# EasyEDA Pro project 15P2D_EDA.eprj

# Schematic SCH

## Sheets
1 P1: Board Name: B1; Create Date: 2024-03-08; Page Name: P1; Project Name: 15P2D_EDA; Schematic Name: SCH; Update Date: 2024-04-16; Company: 嘉立创EDA; Page Size: A4; Version: V1.0
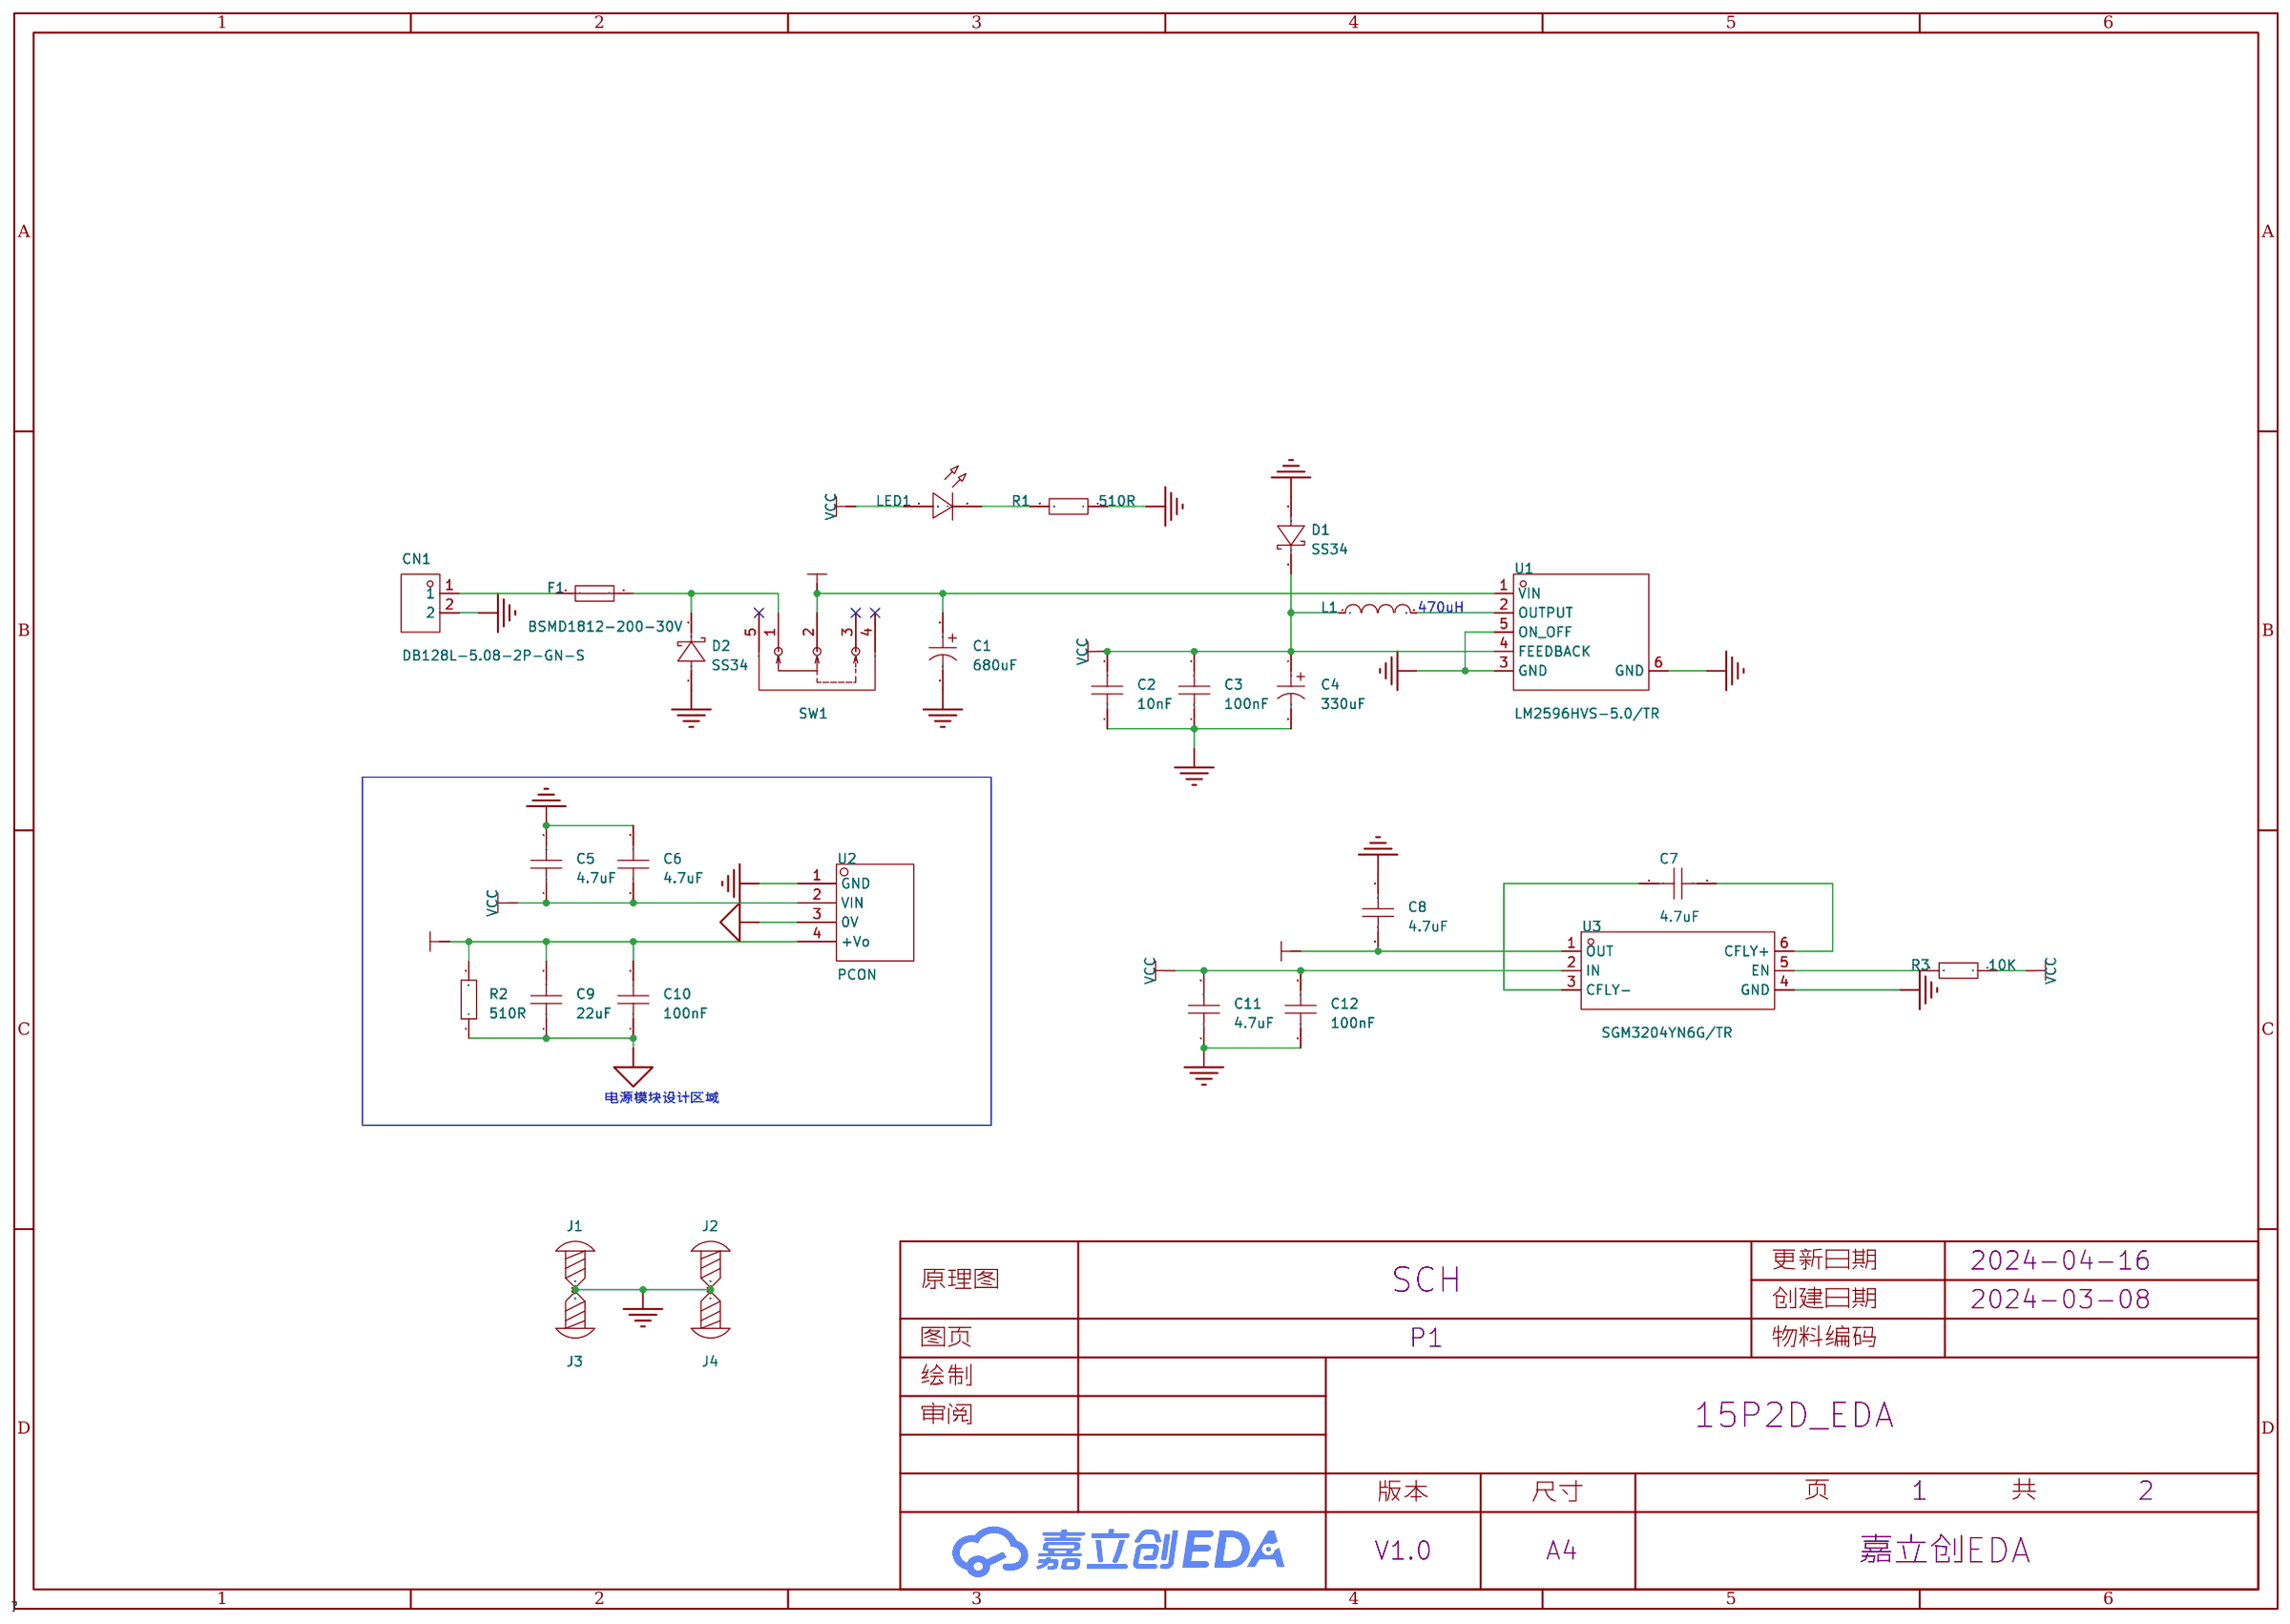
[diagram p0: P1]
2 P2: Create Date: 2024-03-11; Page Name: P2; Update Date: 2024-04-10; Company: EDA设计与开发
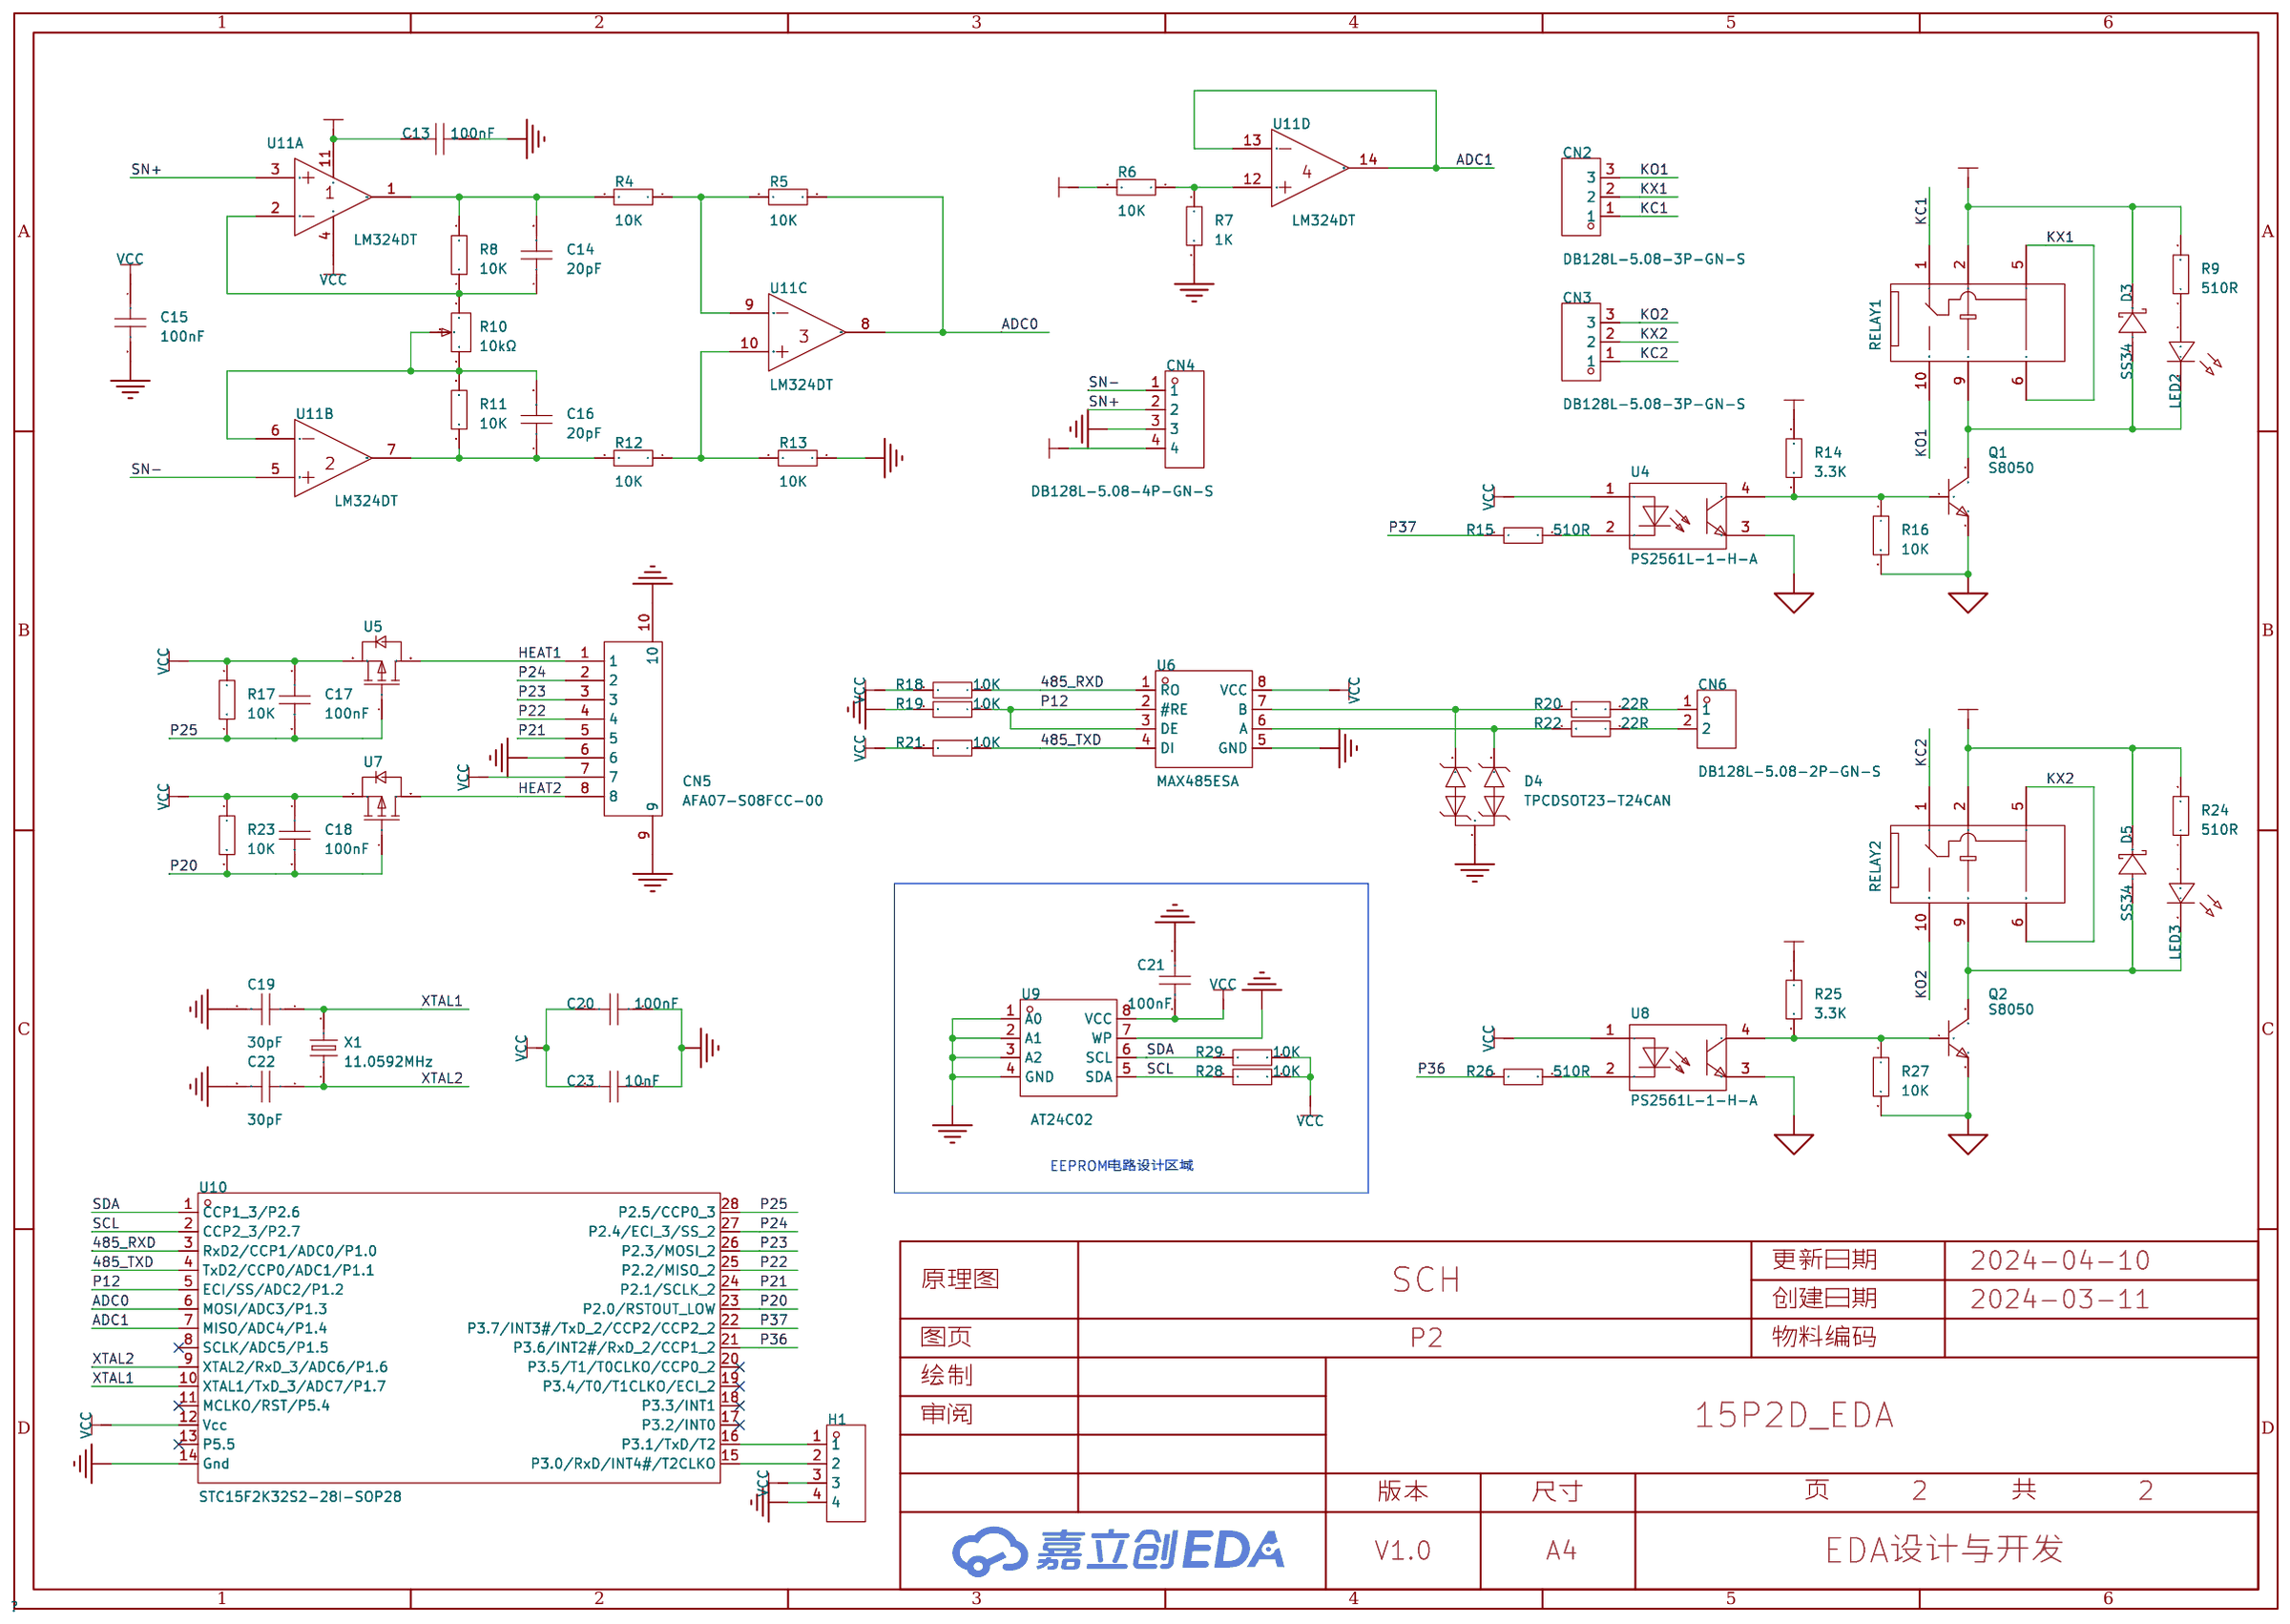
[diagram p1: P2]

## Parts
sheet P1
C1  680uF  [CAP-SMD_BD10.0-L10.3-W10.3-LS11.3-FD]
C2  10nF  [C0805]
C3  100nF  [C0805]
C4  330uF  [CAP-SMD_BD6.3-L6.6-W6.6-LS7.6-RD]
C5  4.7uF  [C1206]
C6  4.7uF  [C1206]
C7  4.7uF  [C1206]
C8  4.7uF  [C1206]
C9  22uF  [C1206]
C10  100nF  [C0805]
C11  4.7uF  [C1206]
C12  100nF  [C0805]
CN1  DB128L-5.08-2P-GN-S  [CONN-TH_2P-P5.08_DB128L-5.08-2P]
D1  SS34  [SMA_L4.3-W2.6-LS5.1-RD]
D2  SS34  [SMA_L4.3-W2.6-LS5.1-RD]
F1  BSMD1812-200-30V  [F1812]
J1  -  [M2螺丝]
J2  -  [M2螺丝]
J3  -  [M2螺丝]
J4  -  [M2螺丝]
L1  470uH  [IND-SMD_L4.0-W4.0]
LED1  -  [LED_TH-3mm]
R1  510R  [R0805]
R2  510R  [R0805]
R3  10K  [R0805]
SW1  SK12D07VG4  [SW-TH_SK12D07VG4]
U1  LM2596HVS-5.0/TR  [TO-263-5_L10.2-W8.9-P1.70-LS15.2-BR]
U2  PCON  [TH_PCON]
U3  SGM3204YN6G/TR  [SOT-23-6_L2.9-W1.6-P0.95-LS2.8-BR]
sheet P2
C13  100nF  [C0805]
C14  20pF  [C0805]
C15  100nF  [C0805]
C16  20pF  [C0805]
C17  100nF  [C0805]
C18  100nF  [C0805]
C19  30pF  [C0805]
C20  100nF  [C0805]
C21  100nF  [C0805]
C22  30pF  [C0805]
C23  10nF  [C0805]
CN2  DB128L-5.08-3P-GN-S  [CONN-TH_DB128L-5.08-3P]
CN3  DB128L-5.08-3P-GN-S  [CONN-TH_DB128L-5.08-3P]
CN4  DB128L-5.08-4P-GN-S  [CONN-TH_4P_DB128L-5.08-4P-GN-S]
CN5  AFA07-S08FCC-00  [FPC-SMD_P1.00-8P_LCS-XJ-H2.5]
CN6  DB128L-5.08-2P-GN-S  [CONN-TH_2P-P5.08_DB128L-5.08-2P]
D3  SS34  [SMA_L4.3-W2.6-LS5.1-RD]
D4  TPCDSOT23-T24CAN  [SOT-23_L2.9-W1.3-P1.90-LS2.4-BR]
D5  SS34  [SMA_L4.3-W2.6-LS5.1-RD]
H1  -  [HDR-TH_4P-P2.54-V-F]
LED2  -  [LED_TH-3mm]
LED3  -  [LED_TH-3mm]
Q1  S8050  [SOT-23_L2.9-W1.3-P1.90-LS2.4-BR]
Q2  S8050  [SOT-23_L2.9-W1.3-P1.90-LS2.4-BR]
R4  10K  [R0805]
R5  10K  [R0805]
R6  10K  [R0805]
R7  1K  [R0805]
R8  10K  [R0805]
R9  510R  [R0805]
R10  10kΩ  [RES-ADJ-TH_3P-L10.0-W10.0-P2.50-BL-BS]
R11  10K  [R0805]
R12  10K  [R0805]
R13  10K  [R0805]
R14  3.3K  [R0805]
R15  510R  [R0805]
R16  10K  [R0805]
R17  10K  [R0805]
R18  10K  [R0805]
R19  10K  [R0805]
R20  22R  [R0805]
R21  10K  [R0805]
R22  22R  [R0805]
R23  10K  [R0805]
R24  510R  [R0805]
R25  3.3K  [R0805]
R26  510R  [R0805]
R27  10K  [R0805]
R28  10K  [R0805]
R29  10K  [R0805]
RELAY1  G5V-1 DC5  [RELAY-TH_G5V-1]
RELAY2  G5V-1 DC5  [RELAY-TH_G5V-1]
U4  PS2561L-1-H-A  [SOP-4_L6.5-W4.6-P2.54-LS9.6-TL]
U5  SI2301-ZE  [SOT-23_L2.9-W1.3-P1.90-LS2.4-BR]
U6  MAX485ESA  [SOP-8_L5.0-W4.0-P1.27-LS6.0-BL]
U7  SI2301-ZE  [SOT-23_L2.9-W1.3-P1.90-LS2.4-BR]
U8  PS2561L-1-H-A  [SOP-4_L6.5-W4.6-P2.54-LS9.6-TL]
U9  AT24C02  [SOP-8_L4.9-W3.9-P1.27-LS6.0-BL]
U10  STC15F2K32S2-28I-SOP28  [SOP-28_L17.9-W7.5-P1.27-LS10.3-BL]
U11  LM324DT  [SOIC-14_L8.7-W3.9-P1.27-LS6.0-BL]  (sections 1,2,3,4)
X1  11.0592MHz  [HC-49US_L11.5-W4.5-P4.88]

## Library data of the parts
C1 = 126RV0105: 容值:680uF;精度:±20%;额定电压:35V;纹波电流:380mA;; LCSC Part Name: 680uF ±20% 35V; Supplier Part: C7461236; Manufacturer: KNSCHA(科尼盛); Supplier Footprint: SMD,D10xL10.5mm; JLCPCB Part Class: Extended Part; Datasheet: https://atta.szlcsc.com/upload/public/pdf/source/20230711/6451BDCB5B323B6F7EF00B061BF0BEEC.pdf; Supplier: LCSC; Tolerance: ±20%; Rated Voltage: 35V; Ripple Current: 380mA; φD: 10mm; L: 10.5mm; Lifetime @ Temp: 2000hrs@105℃; Operating Temperature: -55℃~+105℃
C2 C3 C10 C12-C23 = CAP_0805: Supplier Footprint: 0805
C4 = 126RV0107: 容值:330uF;精度:±20%;额定电压:16V;纹波电流:170mA;; LCSC Part Name: 330uF ±20% 16V; Supplier Part: C7461238; Manufacturer: KNSCHA(科尼盛); Supplier Footprint: SMD,D6.3xL7.7mm; JLCPCB Part Class: Extended Part; Datasheet: https://atta.szlcsc.com/upload/public/pdf/source/20230711/6451BDCB5B323B6F7EF00B061BF0BEEC.pdf; Supplier: LCSC; Tolerance: ±20%; Rated Voltage: 16V; Ripple Current: 170mA; φD: 6.3mm; L: 7.7mm; Lifetime @ Temp: 2000hrs@105℃; Operating Temperature: -55℃~+105℃
C5-C9 C11 = CL31A226KOHNNNE: 容值:22uF;精度:±10%;额定电压:16V;材质(温度系数):X5R;; LCSC Part Name: 22uF ±10% 16V; Supplier Part: C90146; Manufacturer: SAMSUNG(三星); Supplier Footprint: 1206; JLCPCB Part Class: 扩展库; Datasheet: https://atta.szlcsc.com/upload/public/pdf/source/20161228/1482890861309.pdf; Supplier: LCSC; Tolerance: ±10%; Voltage Rated: 16V; Temperature Coefficient: X5R
CN1 CN6 = DB128L-5.08-2P-GN-S: 结构:1x2P;间距:5.08mm;颜色:绿色;安装方式:直插;额定电流:18A;额定电压:250V;排数:1;线规 - AWG:12~30;线规 - 平方毫米:2.5;每排PIN数:2;工作温度范围:-40℃~+105℃;; LCSC Part Name: 5.08mm 1x2P 排数:1 每排P数:2 直插; Supplier Part: C395868; Manufacturer: DORABO(地博电气); Supplier Footprint: 插件,P=5.08mm; JLCPCB Part Class: 扩展库; Datasheet: https://atta.szlcsc.com/upload/public/pdf/source/20230106/B067FE0E641A396A370D47F93C345689.pdf; Supplier: LCSC; Structure: 1x2P; Pitch: 5.08mm; Color: 绿色; Mounting Style: 直插; Current Rating (Max): 18A; Voltage Rating (Max): 250V; Number of Pins: 2P; Number of Rows: 1; Wire Gauge - AWG: 12~30; Wire Gauge - mm2: 2.5; Number of PINs Per Row: 2; Operating Temperature Range: -40℃~+105℃
D1-D3 D5 = SS34_C727060: 二极管配置:独立式;正向压降(Vf):550mV@3A;直流反向耐压(Vr):40V;平均整流电流(Io):3A;; LCSC Part Name: 电压:40V 电流:3A; Supplier Part: C727060; Manufacturer: TWGMC(台湾迪嘉); Supplier Footprint: SMA(DO-214AC); JLCPCB Part Class: 扩展库; Datasheet: https://atta.szlcsc.com/upload/public/pdf/source/20200828/C727059_6599B6CAC5F3238B9C33E46794659DBE.pdf; Supplier: LCSC; Diode Configuration: 独立式; Forward Voltage (Vf@If): 550mV@3A; Reverse Voltage (Vr): 40V; Average Rectified Current (Io): 3A; Reverse Leakage Current (Ir): 500uA@40V
F1 = BSMD1812-200-30V: 最大电压:30V;最大电流:40A;保持电流:2A;跳闸电流:4A;; LCSC Part Name: 30V 2A 1812自恢复; Supplier Part: C960026; Manufacturer: BHFUSE(佰宏); Supplier Footprint: 1812; JLCPCB Part Class: 扩展库; Datasheet: https://atta.szlcsc.com/upload/public/pdf/source/20230512/6ED7FF50F668B3AF958C55F12246A840.pdf; Supplier: LCSC; Operating Voltage (Max): 30V; Current Rating (Max): 40A; Hold Current: 2A; Trip Current: 4A; Power Dissipation: 1W; Resistance - Initial (Ri) (Min): 20mΩ; Resistance - Post Trip (R1) (Max): 100mΩ; Maximum Time to Trip: 2s; Operating Temperature: -40℃~+85℃
J1-J4 = M2螺丝: Supplier Footprint: 插件
L1 = YPRH1209-471M: 电感值:470uH;精度:±20%;额定电流:1.06A;; LCSC Part Name: 470uH ±20%; Supplier Part: C718309; Manufacturer: YJYCOIN(益嘉源); Supplier Footprint: SMD,12x12mm; JLCPCB Part Class: 扩展库; Datasheet: https://atta.szlcsc.com/upload/public/pdf/source/20200623/C339955_D39FA66995A9BB8553FDBD7D9E6E5CB5.pdf; Supplier: LCSC; Tolerance: ±20%; Rated Current: 1.06A; DC Resistance (DCR): 471mΩ
LED1 = LED_TH-R_3mm: Supplier Footprint: 插件
R1-R9 R11-R29 = Res_0805: Supplier Footprint: 0805
SW1 = SK12D07VG4: 电路结构:单刀双掷;安装方式:侧插;额定电流(DC):500mA;额定电压(DC):50V;额定电流(AC):-;额定电压(AC):-;机械寿命:5千次;; LCSC Part Name: 3脚2档位 卧插 滑动开关; Supplier Part: C393937; Manufacturer: SHOU HAN(首韩); Supplier Footprint: 插件; JLCPCB Part Class: 扩展库; Datasheet: https://atta.szlcsc.com/upload/public/pdf/source/20190521/C393937_939FE26E571CC67D2D532E953108A1B0.pdf; Supplier: LCSC; Circuit: 单刀双掷; Actuator Style: 矩形柱状; Pin Style: PC引脚; Switch Height: 8.8mm; Mounting Style: 侧插; Current Rating (DC): 500mA; Voltage Rating (DC): 50V; Mechanical Life: 5千次
U1 = LM2596HVS-5.0/TR: Supplier Part: C7421039; Manufacturer: HGSEMI(华冠); Supplier Footprint: TO-263-5; Datasheet: https://atta.szlcsc.com/upload/public/pdf/source/20230608/50F81A07F1CB4120FC66F79925E72406.pdf; Supplier: LCSC
U2 = PCON
U3 = SGM3204YN6G/TR: 功能类型:-;输入电压:1.4V~5.5V;输出电压:-5.5V~-1.4V;输出电流(最大值):200mA;; Supplier Part: C194031; Manufacturer: SGMICRO(圣邦微); Supplier Footprint: SOT-23-6; JLCPCB Part Class: 扩展库; Datasheet: https://atta.szlcsc.com/upload/public/pdf/source/20180627/C194031_755051E53122D645C36CF727711B963E.pdf; Supplier: LCSC; Input Voltage: 1.4V~5.5V; Output Voltage: -5.5V~-1.4V; Output Current (Max): 200mA; Switching Frequency: 950kHz; Number of Outputs: 1; Switch tube (built-in/external): 内置
CN2 CN3 = DB128L-5.08-3P-GN-S: 结构:1x3P;间距:5.08mm;颜色:绿色;安装方式:直插;额定电流:18A;额定电压:250V;排数:1;线规 - AWG:12~30;线规 - 平方毫米:2.5;每排PIN数:3;工作温度范围:-40℃~+105℃;; LCSC Part Name: 5.08mm 1x3P 排数:1 每排P数:3 直插; Supplier Part: C395869; Manufacturer: DORABO(地博电气); Supplier Footprint: 插件,P=5.08mm; JLCPCB Part Class: 扩展库; Datasheet: https://atta.szlcsc.com/upload/public/pdf/source/20230106/B067FE0E641A396A370D47F93C345689.pdf; Supplier: LCSC; Structure: 1x3P; Pitch: 5.08mm; Color: 绿色; Mounting Style: 直插; Current Rating (Max): 18A; Voltage Rating (Max): 250V; Number of Pins: 3P; Number of Rows: 1; Wire Gauge - AWG: 12~30; Wire Gauge - mm2: 2.5; Number of PINs Per Row: 3; Operating Temperature Range: -40℃~+105℃
CN4 = DB128L-5.08-4P-GN-S: 结构:1x4P;间距:5.08mm;颜色:绿色;安装方式:直插;额定电流:18A;额定电压:250V;排数:1;线规 - AWG:12~30;线规 - 平方毫米:2.5;每排PIN数:4;工作温度范围:-40℃~+105℃;; LCSC Part Name: 5.08mm 1x4P 排数:1 每排P数:4 直插; Supplier Part: C2827883; Manufacturer: DORABO(地博电气); Supplier Footprint: 插件,P=5.08mm; JLCPCB Part Class: 扩展库; Datasheet: https://atta.szlcsc.com/upload/public/pdf/source/20230106/B067FE0E641A396A370D47F93C345689.pdf; Supplier: LCSC; Structure: 1x4P; Pitch: 5.08mm; Color: 绿色; Mounting Style: 直插; Current Rating (Max): 18A; Voltage Rating (Max): 250V; Number of Pins: 4P; Number of Rows: 1; Wire Gauge - AWG: 12~30; Wire Gauge - mm2: 2.5; Number of PINs Per Row: 4; Operating Temperature Range: -40℃~+105℃
CN5 = AFA07-S08FCC-00: 锁定特性:抽屉式;触点类型:下接;触点数量:8P;间距:1mm;安装类型:卧贴;; LCSC Part Name: 间距:1mm P数:8P 抽屉式 下接; Supplier Part: C262342; Manufacturer: JS(钜硕电子); Supplier Footprint: SMD,P=1mm,卧贴; JLCPCB Part Class: 扩展库; Datasheet: https://atta.szlcsc.com/upload/public/pdf/source/20191217/C262716_30B15E9A77BFCA4A54741C92DB3BE8CC.pdf; Supplier: LCSC; Locking Feature: 抽屉式; Contact Type: 下接; Number of Contacts: 8P; Pitch: 1mm; Mounting Type: 卧贴; FFC, FCB Thickness: 0.3mm; Height Above Board: 2.5mm
D4 = TPCDSOT23-T24CAN: Supplier Part: C970033; Manufacturer: TECH PUBLIC(台舟); Supplier Footprint: SOT-23; JLCPCB Part Class: 扩展库; Datasheet: https://atta.szlcsc.com/upload/public/pdf/source/20230522/C1F3B36253468277A14BE124FFAB154C.pdf; Supplier: LCSC
H1 = HDR-F_2.54_1x4P: Supplier Part: C2718488; Supplier Footprint: 插件
LED2 LED3 = LED_TH-G_3mm: Supplier Footprint: 插件
Q1 Q2 = S8050_C2891804: 晶体管类型:NPN;集电极电流(Ic):500mA;集射极击穿电压(Vceo):25V;功率(Pd):300mW;; LCSC Part Name: NPN 电流:500mA 耐压:25V; Supplier Part: C2891804; Manufacturer: YONGYUTAI(永裕泰); Supplier Footprint: SOT-23; JLCPCB Part Class: Extended Part; Datasheet: https://atta.szlcsc.com/upload/public/pdf/source/20210901/5347316A10609C628D4D69AE01446E5B.pdf; Supplier: LCSC; Transistor Type: NPN; Collector Current (Ic): 500mA; Collector-Emitter Breakdown Voltage (Vceo): 25V; Power Dissipation (Pd): 300mW; Collector Cut-Off Current (Icbo): 1uA; Collector-Emitter Saturation Voltage (VCE(sat)@Ic,Ib): 500mV@500mA,50mA
R10 = 3296W-1-203LF: 阻值:20kΩ;精度:±10%;功率:500mW;温度系数:±100ppm/℃;; LCSC Part Name: 20kΩ ±10%; Supplier Part: C34845; Manufacturer: BOURNS; Supplier Footprint: 插件; JLCPCB Part Class: 扩展库; Datasheet: https://atta.szlcsc.com/upload/public/pdf/source/20151026/1457707506403.pdf; Supplier: LCSC; Tolerance: ±10%; Power(Watts): 500mW; Temperature Coefficient: ±100ppm/℃; Turns: 25
RELAY1 RELAY2 = G5V-1 DC5: 线圈电压:5V;触点形式:一组转换:1C(单刀双掷-转换);触点容量(电阻负载):-;最大切换电压:125V@AC；60V@DC;最大切换电流:1A;; LCSC Part Name: 继电器G5V-1-5VDC; Supplier Part: C28695; Manufacturer: OMRON(欧姆龙); Supplier Footprint: DIP,7.5x12.5mm; JLCPCB Part Class: 扩展库; Supplier: LCSC; Coil Voltage: 5V; Contact Form: 一组转换:1C(单刀双掷-转换); Maximum Switching Voltage: 125V@AC；60V@DC; Contact Material: 银+镀金; Maximum Switching Current: 1A; Operate Time: 5ms; Release Time: 5ms; Operating Temperature: -40℃~+70℃
U4 U8 = PS2561L-1-H-A: Supplier Part: C145672; Manufacturer: California Eastern Laboratories; Supplier Footprint: SOP-4-2.54mm; JLCPCB Part Class: 扩展库; Datasheet: https://atta.szlcsc.com/upload/public/pdf/source/20180125/C145673_15168615431091301608.pdf; Supplier: LCSC
U5 U7 = SI2301-ZE: 类型:P沟道;漏源电压(Vdss):20V;连续漏极电流(Id):2.3A;功率(Pd):700mW;导通电阻(RDS(on)@Vgs,Id):126mΩ@4.5V;阈值电压(Vgs(th)@Id):1V@250uA;; LCSC Part Name: P沟道 耐压:20V 电流:2.3A; Supplier Part: C5261052; Manufacturer: HXY MOSFET(华轩阳电子); Supplier Footprint: SOT-23; JLCPCB Part Class: 扩展库; Datasheet: https://atta.szlcsc.com/upload/public/pdf/source/20230515/2FF2907841563ED329594D3237822724.pdf; Supplier: LCSC; Type: P沟道; Drain Source Voltage (Vdss): 20V; Continuous Drain Current (Id): 2.3A; Power Dissipation (Pd): 700mW; Drain Source On Resistance (RDS(on)@Vgs,Id): 126mΩ@4.5V; Gate Threshold Voltage (Vgs(th)@Id): 1V@250uA; Input Capacitance (Ciss@Vds): 285pF
U6 = MAX485ESA_C668206: Supplier Part: C668206; Manufacturer: UMW(友台半导体); Supplier Footprint: SOP-8; JLCPCB Part Class: 扩展库; Datasheet: https://atta.szlcsc.com/upload/public/pdf/source/20231109/489730AE87B90C4B6B8CE65C07B1054C.pdf; Supplier: LCSC
U9 = AT24C02_C7470930: 接口类型:I2C;存储容量:2Kbit;时钟频率(fc):400kHz~1MHz;; LCSC Part Name: AT24C02  2Kbit 12C; Supplier Part: C7470930; Manufacturer: HXY MOSFET(华轩阳电子); Supplier Footprint: SOP-8; JLCPCB Part Class: 扩展库; Datasheet: https://atta.szlcsc.com/upload/public/pdf/source/20230913/748AF0FF0068DF582FAC58AD968E8A28.pdf; Supplier: LCSC; Interface Type: I2C; Memory Size: 2Kbit; Clock Frequency (fc): 400kHz~1MHz; Supply Voltage: 1.8V~5.5V; Data Retention - TDR (Year): 100年
U10 = STC15F2K32S2-28I-SOP28: LCSC Part Name: STC15F2K32S2-28I- SOP28; Supplier Part: C194605; Manufacturer: STC(宏晶); Supplier Footprint: SOP-28-300mil; JLCPCB Part Class: 扩展库; Datasheet: https://atta.szlcsc.com/upload/public/pdf/source/20180730/C194606_29BB2C4DE21484D9E9511E7CB40FB26F.pdf; Supplier: LCSC
U11 = LM324DT: 放大器数:四路;增益带宽积(GBP):1.3MHz;输入偏置电流(Ib):20nA;压摆率(SR):0.4V/us;带宽(-3db):-;; Supplier Part: C71035; Manufacturer: ST(意法半导体); Supplier Footprint: SOIC-14; JLCPCB Part Class: 基础库; Datasheet: https://atta.szlcsc.com/upload/public/pdf/source/20160408/1460100649718.pdf; Supplier: LCSC; Number of Circuits: 四路; Gain Bandwidth Product(GBP): 1.3MHz; Current - Input Bias(Ib): 20nA; Slew Rate(SR): 0.4V/us; Output Current: 40mA; Supply Current: 1.5mA; Operating Temperature: 0℃~+70℃
X1 = TAXD11.0592M2GLFBET2T: 晶振类型:直插晶振;频率:11.0592MHz;常温频差:±30ppm;外接负载电容:20pF;频率稳定度(全温):±30ppm;; LCSC Part Name: 11.0592MHz ±30ppm 20pF; Supplier Part: C127675; Manufacturer: YJX(雅晶鑫); Supplier Footprint: HC-49S; JLCPCB Part Class: 扩展库; Datasheet: https://atta.szlcsc.com/upload/public/pdf/source/20170914/C127676_1505359415156967690.pdf; Supplier: LCSC; Crystal Type: 直插晶振; Normal temperature Frequency Tolerance: ±30ppm; External load capacitor: 20pF; Frequency Stability(Full temperature range): ±30ppm; Equivalent Series Resistance (ESR): 50Ω; Operating Temperature: -20℃~+70℃

## Nets
GND: C1.2 C2.1 C3.1 C4.2 C5.2 C6.2 C8.1 C11.1 C12.1 C13.1 C15.2 C19.2 C20.1 C21.2 C22.2 C23.1 CN1.2 CN4.3 CN5.6 CN5.9 CN5.10 D1.2(A) D2.2(A) D4.3 H1.4 J1.1 J2.1 J3.1 J4.1 R1.1 R7.2 R13.1 R19.2 U1.3(GND) U1.5(ON_OFF) U1.6(GND) U2.1(GND) U3.4(GND) U6.5(GND) U9.1(A0) U9.2(A1) U9.3(A2) U9.4(GND) U9.7(WP) U10.14(Gnd)
VBAT: C1.1 CN4.4 R6.2 SW1.2 U1.1(VIN)
VCC: C2.2 C3.2 C4.1 C5.1 C6.1 C11.2 C12.2 C15.1 C17.1 C18.1 C20.2 C21.1 C23.2 CN5.7 D1.1(C) H1.3 L1.1 LED1.1(C) R3.1 R17.1 R18.2 R21.2 R23.1 R28.2 R29.2 U1.4(FEEDBACK) U2.2(VIN) U3.2(IN) U4.1 U5.2(S) U6.8(VCC) U7.2(S) U8.1 U9.8(VCC) U10.12(Vcc) U11.4(VCC+)
VEE: C8.2 C13.2 U3.1(OUT) U11.11(VCC-)
0: C9.1 C10.1 Q1.2(E) Q2.2(E) R2.1 R16.2 R27.2 U2.3(0V) U4.3 U8.3
485_RXD: R18.1 U6.1(RO) U10.3(RxD2/CCP1/ADC0/P1.0)
485_TXD: R21.1 U6.4(DI) U10.4(TxD2/CCP0/ADC1/P1.1)
ADC0: R5.1 U10.6(MOSI/ADC3/P1.3) U11.8(OUT3)
ADC1: U10.7(MISO/ADC4/P1.4) U11.13(IN4-) U11.14(OUT4)
HEAT1: CN5.1 U5.3(D)
HEAT2: CN5.8 U7.3(D)
KC1: CN2.1 RELAY1.1
KC2: CN3.1 RELAY2.1
KO1: CN2.3 RELAY1.10
KO2: CN3.3 RELAY2.10
KX1: CN2.2 RELAY1.5 RELAY1.6
KX2: CN3.2 RELAY2.5 RELAY2.6
P12: R19.1 U6.2(#RE) U6.3(DE) U10.5(ECI/SS/ADC2/P1.2)
P20: C18.2 R23.2 U7.1(G) U10.23(P2.0/RSTOUT_LOW)
P21: CN5.5 U10.24(P2.1/SCLK_2)
P22: CN5.4 U10.25(P2.2/MISO_2)
P23: CN5.3 U10.26(P2.3/MOSI_2)
P24: CN5.2 U10.27(P2.4/ECI_3/SS_2)
P25: C17.2 R17.2 U5.1(G) U10.28(P2.5/CCP0_3)
P36: R26.1 U10.21(P3.6/INT2#/RxD_2/CCP1_2)
P37: R15.1 U10.22(P3.7/INT3#/TxD_2/CCP2/CCP2_2)
SCL: R28.1 U9.5(SDA) U10.2(CCP2_3/P2.7)
SDA: R29.1 U9.6(SCL) U10.1(CCP1_3/P2.6)
SN+: CN4.2 U11.3(IN1+)
SN-: CN4.1 U11.5(IN2+)
VRM: C9.2 C10.2 D3.1(C) D5.1(C) R2.2 R9.2 R14.1 R24.2 R25.1 RELAY1.2 RELAY2.2 U2.4(+Vo)
XTAL1: C19.1 U10.10(XTAL1/TxD_3/ADC7/P1.7) X1.2
XTAL2: C22.1 U10.9(XTAL2/RxD_3/ADC6/P1.6) X1.1
$1N5406: CN1.1 F1.1
$1N6010: L1.2 U1.2(OUTPUT)
$1N7874: R3.2 U3.5(EN)
$1N8048: C7.2 U3.6(CFLY+)
$1N8053: C7.1 U3.3(CFLY-)
$1N8284: LED1.2(A) R1.2
$1N8627: D2.1(C) F1.2 SW1.1
$2N2031: C16.1 R11.1 R12.2 U11.7(OUT2)
$2N2092: R12.1 R13.2 U11.10(IN3+)
$2N2099: R4.1 R5.2 U11.9(IN3-)
$2N2266: C14.1 R8.1 R10.1 U11.2(IN1-)
$2N2273: C14.2 R4.2 R8.2 U11.1(OUT1)
$2N2314: C16.2 R10.2 R10.3 R11.2 U11.6(IN2-)
$2N3023: CN6.1 R20.1
$2N3053: CN6.2 R22.1
$2N3244: D4.1 R22.2 U6.6(A)
$2N3251: D4.2 R20.2 U6.7(B)
$2N3377: R15.2 U4.2
$2N3466: Q1.1(B) R14.2 R16.1 U4.4
$2N4164: R26.2 U8.2
$2N4168: Q2.1(B) R25.2 R27.1 U8.4
$2N4738: LED2.1(C) R9.1
$2N4742: D3.2(A) LED2.2(A) Q1.3(C) RELAY1.9
$2N4893: LED3.1(C) R24.1
$2N4914: D5.2(A) LED3.2(A) Q2.3(C) RELAY2.9
$2N5025: R6.1 R7.1 U11.12(IN4+)
$2N7138: H1.1 U10.16(P3.1/TxD/T2)
$2N7141: H1.2 U10.15(P3.0/RxD/INT4#/T2CLKO)

Not connected (* = marked no-connect by the designer): SW1 3* 4* 5*; U10 8(SCLK/ADC5/P1.5)* 11(MCLKO/RST/P5.4)* 13(P5.5)* 17(P3.2/INT0)* 18(P3.3/INT1)* 19(P3.4/T0/T1CLKO/ECI_2)* 20(P3.5/T1/T0CLKO/CCP0_2)*

## Notes on the sheets
sheet 1
- 电源模块设计区域
sheet 2
- EEPROM电路设计区域

# Board PCB
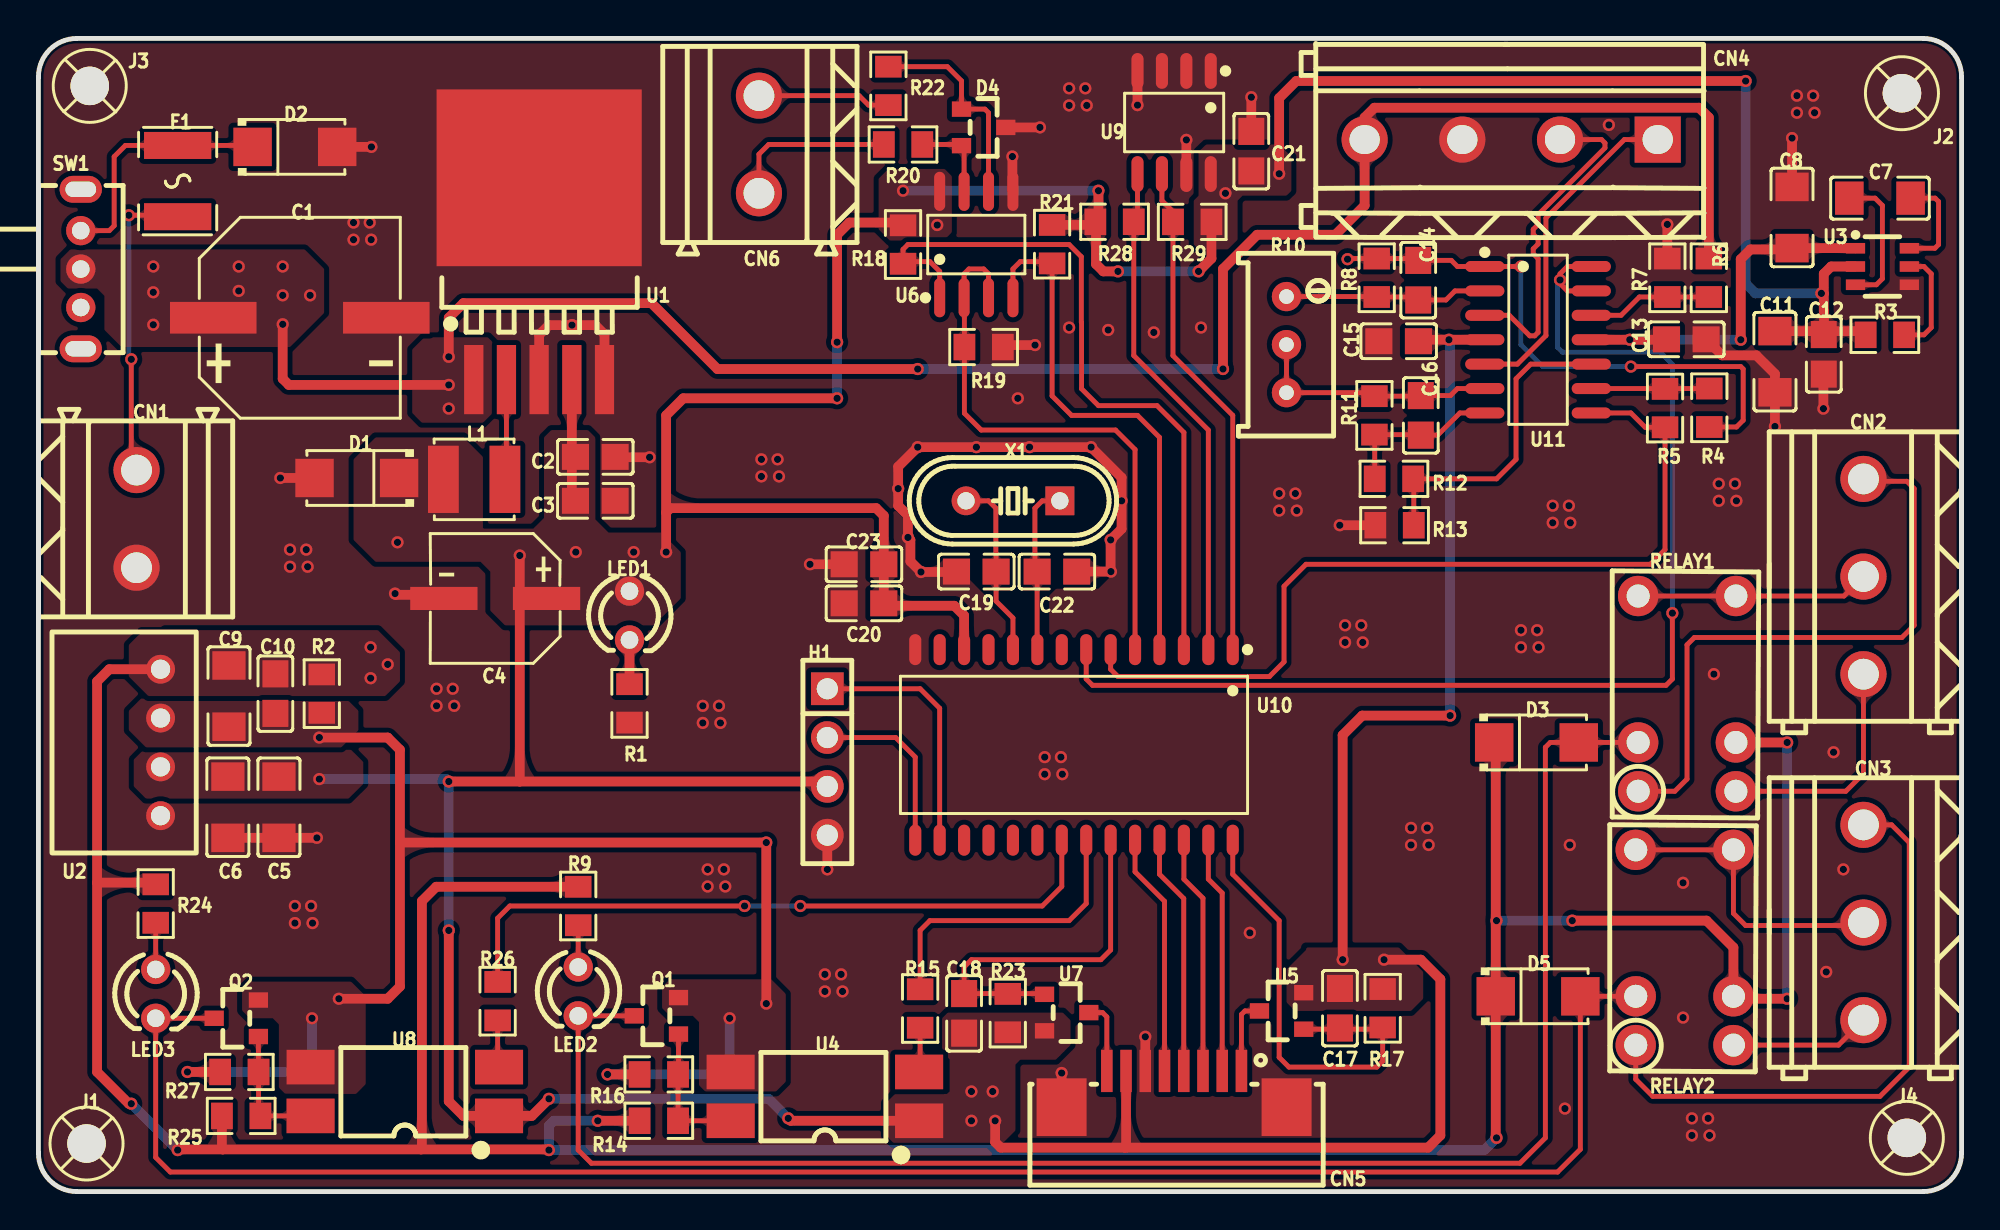
[diagram p2: board, top side]
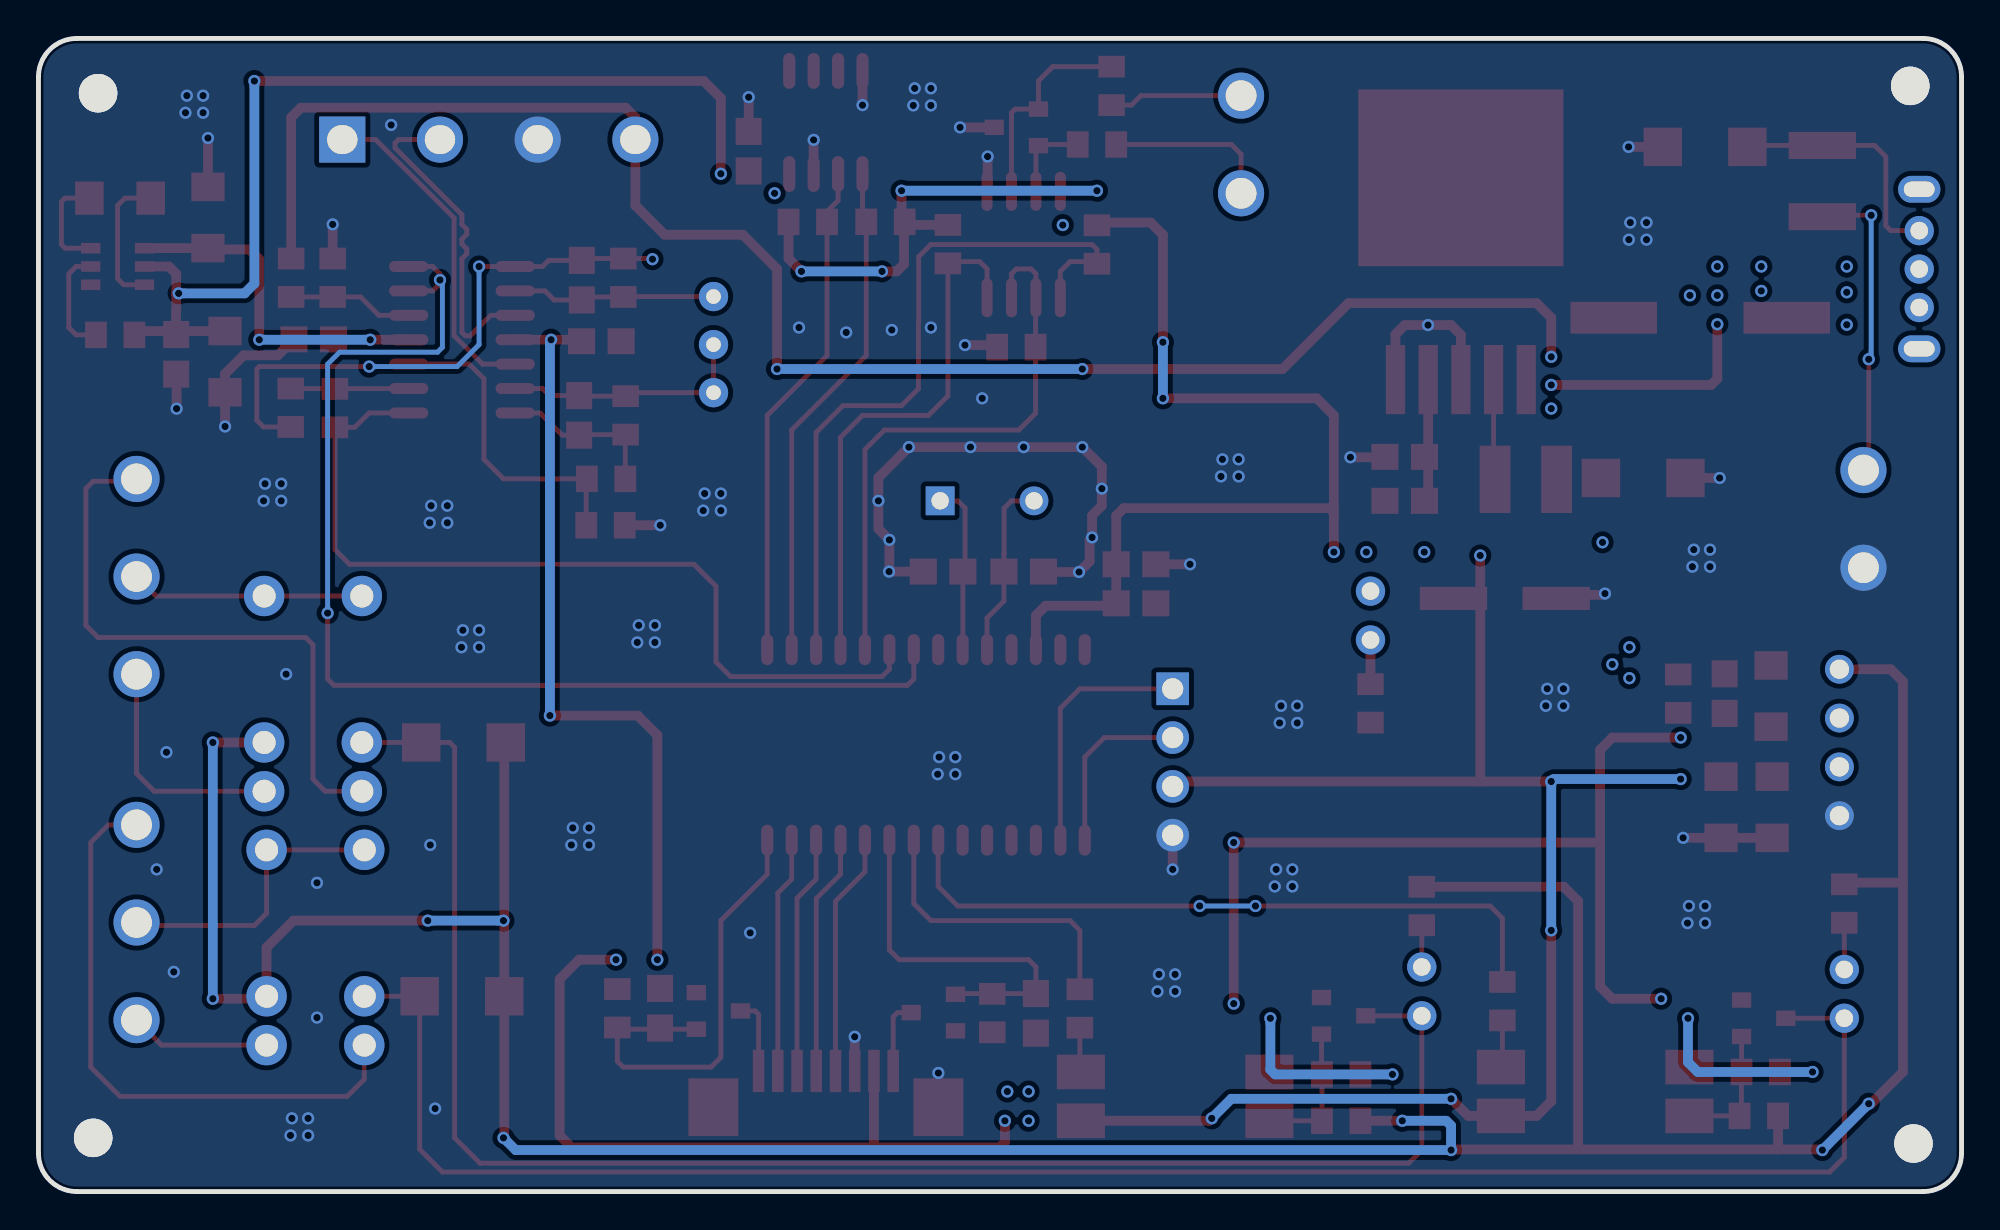
[diagram p3: board, bottom side, seen from below]

Outline 100 x 60 mm; copper layers: Top Layer, Bottom Layer. Coordinates in mm from the lower left corner of the outline.
Outline path: 0,58 0,2 arc(0.59,0.59) 2,0 98,0 arc(99.41,0.59) 100,2 100,58 arc(99.41,59.41) 98,60 2,60 arc(0.59,59.41) 0,58
Stack: Top Layer 0.035mm / Dielectric1 1.51mm FR4 er 4.5 / Bottom Layer 0.035mm

## Design rules (mm)
net SN+: SN
net SN-: SN
template: 自定义配置
spacing copperThickness1oz (default): track to track 0.203, other pairs 0.178 to 0.203
spacing copperThickness2oz: track to track 0.203, other pairs 0.203 to 0.203
track width copperThickness1oz (default): min 0.254, default 0.254, max 0.508
track width copperThickness2oz: min 0.203, default 0.254, max 2.54
differential pair differentialPair (default): width min 0.127, default 0.254, max 2.54; gap min 0.152, default 0.152
via viaSize (default): diameter min 0.635, default 0.635, max 0.635; hole min 0.381, default 0.381, max 0.381

## Placement (name value [footprint] x y rotation side)
C1  680uF  [CAP-SMD_BD10.0-L10.3-W10.3-LS11.3-FD]  13.59 45.47 0 top
C2  10nF  [C0805]  28.96 38.23 180 top
C3  100nF  [C0805]  28.96 35.94 180 top
C4  330uF  [CAP-SMD_BD6.3-L6.6-W6.6-LS7.6-RD]  23.75 30.86 180 top
C5  4.7uF  [C1206]  12.5 20 270 top
C6  4.7uF  [C1206]  9.85 20 270 top
C7  4.7uF  [C1206]  95.76 51.69 0 top
C8  4.7uF  [C1206]  91.19 50.68 270 top
C9  22uF  [C1206]  9.91 25.78 90 top
C10  100nF  [C0805]  12.32 25.91 90 top
C11  4.7uF  [C1206]  90.3 43.18 90 top
C12  100nF  [C0805]  92.84 43.56 90 top
C13  100nF  [C0805]  85.69 44.34 180 top
C14  20pF  [C0805]  71.75 47.42 90 top
C15  100nF  [C0805]  70.73 44.25 180 top
C16  20pF  [C0805]  71.88 40.39 90 top
C17  100nF  [C0805]  67.68 9.54 270 top
C18  100nF  [C0805]  48.13 9.27 90 top
C19  30pF  [C0805]  48.77 32.26 180 top
C20  100nF  [C0805]  42.93 30.61 0 top
C21  100nF  [C0805]  63.07 54.13 90 top
C22  30pF  [C0805]  52.96 32.26 0 top
C23  10nF  [C0805]  42.93 32.64 0 top
CN1  DB128L-5.08-2P-GN-S  [CONN-TH_2P-P5.08_DB128L-5.08-2P]  5.1 35 270 top
CN2  DB128L-5.08-3P-GN-S  [CONN-TH_DB128L-5.08-3P]  94.9 32 90 top
CN3  DB128L-5.08-3P-GN-S  [CONN-TH_DB128L-5.08-3P]  94.9 14 90 top
CN4  DB128L-5.08-4P-GN-S  [CONN-TH_4P_DB128L-5.08-4P-GN-S]  76.58 54.74 0 top
CN5  AFA07-S08FCC-00  [FPC-SMD_P1.00-8P_LCS-XJ-H2.5]  59.06 5.33 180 top
CN6  DB128L-5.08-2P-GN-S  [CONN-TH_2P-P5.08_DB128L-5.08-2P]  37.47 54.48 90 top
D1  SS34  [SMA_L4.3-W2.6-LS5.1-RD]  16.56 37.13 180 top
D2  SS34  [SMA_L4.3-W2.6-LS5.1-RD]  13.33 54.36 0 top
D3  SS34  [SMA_L4.3-W2.6-LS5.1-RD]  77.9 23.37 0 top
D4  TPCDSOT23-T24CAN  [SOT-23_L2.9-W1.3-P1.90-LS2.4-BR]  49.15 55.37 180 top
D5  SS34  [SMA_L4.3-W2.6-LS5.1-RD]  77.98 10.16 0 top
F1  BSMD1812-200-30V  [F1812]  7.24 52.58 90 top
H1  -  [HDR-TH_4P-P2.54-V-F]  41.02 22.35 270 top
J1  -  [M2螺丝]  2.5 2.5 0 top
J2  -  [M2螺丝]  96.9 57.15 0 top
J3  -  [M2螺丝]  2.67 57.53 0 top
J4  -  [M2螺丝]  97.16 2.79 0 top
L1  470uH  [IND-SMD_L4.0-W4.0]  22.66 37.06 0 top
LED1  -  [LED_TH-3mm]  30.73 29.97 270 top
LED2  -  [LED_TH-3mm]  28.07 10.41 270 top
LED3  -  [LED_TH-3mm]  6.1 10.29 270 top
Q1  S8050  [SOT-23_L2.9-W1.3-P1.90-LS2.4-BR]  32.13 9.14 0 top
Q2  S8050  [SOT-23_L2.9-W1.3-P1.90-LS2.4-BR]  10.29 9.02 0 top
R1  510R  [R0805]  30.73 25.4 90 top
R2  510R  [R0805]  14.73 25.91 90 top
R3  10K  [R0805]  96.01 44.58 0 top
R4  10K  [R0805]  86.88 40.78 270 top
R5  10K  [R0805]  84.58 40.77 90 top
R6  10K  [R0805]  86.86 47.55 90 top
R7  1K  [R0805]  84.7 47.55 90 top
R8  10K  [R0805]  69.59 47.55 90 top
R9  510R  [R0805]  28.07 14.86 90 top
R10  10kΩ  [RES-ADJ-TH_3P-L10.0-W10.0-P2.50-BL-BS]  64.9 44.07 0 top
R11  10K  [R0805]  69.47 40.39 90 top
R12  10K  [R0805]  70.49 37.08 180 top
R13  10K  [R0805]  70.52 34.67 0 top
R14  3.3K  [R0805]  32.26 3.68 0 top
R15  510R  [R0805]  45.85 9.53 270 top
R16  10K  [R0805]  32.26 6.1 180 top
R17  10K  [R0805]  69.9 9.54 270 top
R18  10K  [R0805]  44.96 49.28 90 top
R19  10K  [R0805]  49.15 43.94 0 top
R20  22R  [R0805]  44.96 54.48 0 top
R21  10K  [R0805]  52.71 49.3 90 top
R22  22R  [R0805]  44.2 57.53 90 top
R23  10K  [R0805]  50.4 9.29 90 top
R24  510R  [R0805]  6.1 14.99 90 top
R25  3.3K  [R0805]  10.54 3.94 0 top
R26  510R  [R0805]  23.88 9.91 270 top
R27  10K  [R0805]  10.44 6.22 180 top
R28  10K  [R0805]  55.96 50.46 180 top
R29  10K  [R0805]  59.99 50.46 0 top
RELAY1  G5V-1 DC5  [RELAY-TH_G5V-1]  85.72 25.91 90 top
RELAY2  G5V-1 DC5  [RELAY-TH_G5V-1]  85.6 12.7 90 top
SW1  SK12D07VG4  [SW-TH_SK12D07VG4]  2.2 48 270 top
U1  LM2596HVS-5.0/TR  [TO-263-5_L10.2-W8.9-P1.70-LS15.2-BR]  26.03 47.5 270 top
U2  PCON  [TH_PCON]  6.35 19.56 90 top
U3  SGM3204YN6G/TR  [SOT-23-6_L2.9-W1.6-P0.95-LS2.8-BR]  95.88 48.13 180 top
U4  PS2561L-1-H-A  [SOP-4_L6.5-W4.6-P2.54-LS9.6-TL]  40.89 4.95 180 top
U5  SI2301-ZE  [SOT-23_L2.9-W1.3-P1.90-LS2.4-BR]  64.64 9.4 0 top
U6  MAX485ESA  [SOP-8_L5.0-W4.0-P1.27-LS6.0-BL]  48.77 49.28 0 top
U7  SI2301-ZE  [SOT-23_L2.9-W1.3-P1.90-LS2.4-BR]  53.47 9.31 180 top
U8  PS2561L-1-H-A  [SOP-4_L6.5-W4.6-P2.54-LS9.6-TL]  19.05 5.21 180 top
U9  AT24C02  [SOP-8_L4.9-W3.9-P1.27-LS6.0-BL]  59.06 55.63 180 top
U10  STC15F2K32S2-28I-SOP28  [SOP-28_L17.9-W7.5-P1.27-LS10.3-BL]  53.85 23.24 180 top
U11  LM324DT  [SOIC-14_L8.7-W3.9-P1.27-LS6.0-BL]  77.98 44.32 270 top
X1  11.0592MHz  [HC-49US_L11.5-W4.5-P4.88]  50.67 35.94 180 top

## Footprints (pads in the part's own frame, mm; a bottom-side part is the same pattern mirrored in y, then rotated)
C0805
  rect 1.409x1.351 smd: 1(-1.028,0) 2(1.031,0)
C1206
  rect 1.485x1.728 smd: 1(-1.593,0) 2(1.593,0)
CAP-SMD_BD6.3-L6.6-W6.6-LS7.6-RD
  rect 3.5x1.2 smd: 1(-2.67,0) 2(2.67,0)
CAP-SMD_BD10.0-L10.3-W10.3-LS11.3-FD
  rect 4.5x1.65 smd: 1(-4.5,0) 2(4.5,0)
CONN-TH_2P-P5.08_DB128L-5.08-2P
  round 2.4 hole 1.6: 1(-2.54,0) 2(2.54,0)
CONN-TH_4P_DB128L-5.08-4P-GN-S
  rect 2.4x2.4 hole 1.575x1.5: 1(7.62,0)
  round 2.4 hole 1.575x1.5: 2(2.54,0) 3(-2.54,0) 4(-7.62,0)
CONN-TH_DB128L-5.08-3P
  round 2.4 hole 1.6: 1(-5.08,0) 2(0,0) 3(5.08,0)
F1812
  rect 1.407x3.499 smd: 1(-1.853,0) 2(1.853,0)
FPC-SMD_P1.00-8P_LCS-XJ-H2.5
  rect 0.6x2.2 smd: 1(-3.499,-0.943) 2(-2.499,-0.943) 3(-1.5,-0.943) 4(-0.499,-0.943) 5(0.5,-0.943) 6(1.5,-0.943) 7(2.5,-0.943) 8(3.5,-0.943)
  rect 2.6x3 smd: 9(5.85,0.943) 10(-5.85,0.943)
HC-49US_L11.5-W4.5-P4.88
  rect 1.5x1.5 hole 0.9: 1(-2.44,0)
  round 1.5 hole 0.9: 2(2.44,0)
HDR-TH_4P-P2.54-V-F
  rect 1.7x1.7 hole 1.1: 1(-3.81,0)
  round 1.7 hole 1.1: 2(-1.27,0) 3(1.27,0) 4(3.81,0)
IND-SMD_L4.0-W4.0
  rect 1.6x3.5 smd: 1(-1.6,0) 2(1.6,0)
LED_TH-3mm
  round 1.524 hole 0.914: 1(-1.27,0) 2(1.27,0)
M2螺丝
  round 2 hole 2: 1(0,0)
R0805
  rect 1.133x1.377 smd: 1(-1,0) 2(1,0)
RELAY-TH_G5V-1
  round 2.1 hole 1.2: 1(-5.08,-2.54) 2(-2.54,-2.54) 5(5.08,-2.54) 6(5.08,2.54) 9(-2.54,2.54) 10(-5.08,2.54)
RES-ADJ-TH_3P-L10.0-W10.0-P2.50-BL-BS
  round 1.524 hole 0.762: 1(0,2.5) 2(0,0) 3(0,-2.5)
SMA_L4.3-W2.6-LS5.1-RD
  rect 1.999x1.999 smd: 1(-2.2,0) 2(2.2,0)
SOIC-14_L8.7-W3.9-P1.27-LS6.0-BL
  oval 0.574x2.038 smd: 1(-3.81,-2.769) 2(-2.54,-2.769) 3(-1.27,-2.769) 4(0,-2.769) 5(1.27,-2.769) 6(2.54,-2.769) 7(3.81,-2.769) 8(3.81,2.769) 9(2.54,2.769) 10(1.27,2.769) 11(0,2.769) 12(-1.27,2.769) 13(-2.54,2.769) 14(-3.81,2.769)
SOP-4_L6.5-W4.6-P2.54-LS9.6-TL
  rect 2.5x1.8 smd: 1(-4.9,1.27) 2(-4.9,-1.27) 3(4.9,-1.27) 4(4.9,1.27)
SOP-8_L4.9-W3.9-P1.27-LS6.0-BL
  oval 0.63x1.865 smd: 1(-1.905,-2.683) 2(-0.635,-2.683) 3(0.635,-2.683) 4(1.905,-2.683) 5(1.905,2.683) 6(0.635,2.683) 7(-0.635,2.683) 8(-1.905,2.683)
SOP-8_L5.0-W4.0-P1.27-LS6.0-BL
  oval 0.574x2.035 smd: 1(-1.905,-2.768) 2(-0.635,-2.768) 3(0.635,-2.768) 4(1.905,-2.768) 5(1.905,2.768) 6(0.635,2.768) 7(-0.635,2.768) 8(-1.905,2.768)
SOP-28_L17.9-W7.5-P1.27-LS10.3-BL
  oval 0.63x1.615 smd: 1(-8.255,-4.957) 2(-6.985,-4.957) 3(-5.715,-4.957) 4(-4.445,-4.957) 5(-3.175,-4.957) 6(-1.905,-4.957) 7(-0.635,-4.957) 8(0.635,-4.957) 9(1.905,-4.957) 10(3.175,-4.957) 11(4.445,-4.957) 12(5.715,-4.957) 13(6.985,-4.957) 14(8.255,-4.957) 15(8.255,4.957) 16(6.985,4.957) 17(5.715,4.957) 18(4.445,4.957) 19(3.175,4.957) 20(1.905,4.957) 21(0.635,4.957) 22(-0.635,4.957) 23(-1.905,4.957) 24(-3.175,4.957) 25(-4.445,4.957) 26(-5.715,4.957) 27(-6.985,4.957) 28(-8.255,4.957)
SOT-23-6_L2.9-W1.6-P0.95-LS2.8-BR
  rect 1x0.55 smd: 1(1.4,-0.95) 2(1.4,0) 3(1.4,0.95) 4(-1.4,0.95) 5(-1.4,0) 6(-1.4,-0.95)
SOT-23_L2.9-W1.3-P1.90-LS2.4-BR
  rect 1.001x0.8 smd: 1(1.151,-0.95) 2(1.151,0.95) 3(-1.151,0)
SW-TH_SK12D07VG4
  round 1.524 hole 0.914: 1(-2,0) 2(0,0) 3(2,0)
  oval 1.4x2.2 hole 0.8x1.6: 4(4.15,0) 5(-4.15,0)
TH_PCON
  round 1.5 hole 1: 1(0,0) 2(2.54,0) 3(5.08,0) 4(7.62,0)
TO-263-5_L10.2-W8.9-P1.70-LS15.2-BR
  rect 3.6x1 smd: 1(5.25,-3.4) 2(5.25,-1.7) 3(5.25,0) 4(5.25,1.7) 5(5.25,3.4)
  rect 9.2x10.668 smd: 6(-5.25,0)

## Nets
As in the schematic.

Pads without a net: SW1 3 4 5; U10 8 11 13 17 18 19 20

## Via types
v1: diameter 0.635, hole 0.381, Top Layer to Bottom Layer, 192 vias

## Routing (per net, layer and track width the routed paths; a pad name or vN(x,y) marks a point on that pad's centre or on a via; arc(x,y) is an arc through that point)
GND: length 81.1
  Top Layer w0.508: 9.85,18.41 C5.2 v1(14.48,18.41) ; H1.4 v1(41.02,16.76) ; CN5.9 v1(53.21,6.17) ; C8.1 v1(91.19,54.82) ; U1.5 29.44,44.61 28.96,45.08 v1(27.74,45.08) 26.54,45.08 26.03,44.58 U1.3 ; C13.1 87.55,43.51 89.33,43.51 90.3,42.55 C11.1 v1(90.3,39.81) ; U9.4 v1(57.15,56.53) ; C23.1 v1(40.12,32.64) ; 92.82,42.51 v1(92.82,40.74) ; D1.2 v1(12.58,37.13) ; R7.2 v1(84.7,50.33) ; 21.08,31.11 21.01,31.05 18.61,31.05 v1(18.54,31.11) ; U9.7 v1(59.69,54.72) ; CN5.6 v1(57.55,8.05) ; 47.67,32.24 v1(45.89,32.24) 45.34,32.79 45.34,33.91 v1(45.21,34.04) 45.21,35.18 44.7,35.69 v1(44.7,36.58) 44.7,37.72 v1(45.72,38.73) v1(48.77,38.73) v1(51.54,38.73) v1(54.74,38.73) 56.32,37.15 v1(56.32,35.94) 56.32,34.48 v1(55.75,33.91) 55.75,32.27 v1(55.77,32.26) C22.2 ; D4.3 v1(52.08,55.37) ; 50.04,44.05 v1(51.82,44.05) ; 69.44,34.67 v1(67.67,34.67) ; 50.64,52.08 v1(50.64,53.86) ; D2.2 v1(17.31,54.36) ; 30,38.21 v1(31.78,38.21) ; C21.2 v1(63.07,56.94)
  vias: v1(13.08,33.4) v1(13.08,32.51) v1(13.33,14.86) v1(13.33,13.97) v1(13.92,33.4) v1(14,32.51) v1(14.18,14.86) v1(14.25,13.97) v1(16.38,50.42) v1(16.38,49.53) v1(17.23,50.42) v1(17.3,49.53) v1(20.7,26.16) v1(20.7,25.27) v1(21.54,26.16) v1(21.62,25.27) v1(34.54,25.27) v1(34.54,24.38) v1(34.8,16.76) v1(34.8,15.88) v1(35.39,25.27) v1(35.46,24.38) v1(35.64,16.76) v1(35.71,15.88) v1(37.59,38.1) v1(37.59,37.21) v1(38.43,38.1) v1(38.51,37.21) v1(40.89,11.3) v1(40.89,10.41) v1(41.74,11.3) v1(41.81,10.41) v1(50.93,41.28) v1(52.32,22.61) v1(52.32,21.72) v1(53.17,22.61) v1(53.24,21.72) v1(53.59,57.4) v1(53.59,56.52) v1(53.59,44.96) v1(54.44,57.4) v1(54.51,56.52) v1(55.63,44.83) v1(58,44.7) v1(60.45,44.96) v1(62.99,13.46) v1(64.52,36.32) v1(64.52,35.43) v1(65.36,36.32) v1(65.43,35.43) v1(67.94,29.46) v1(67.94,28.58) v1(68.79,29.46) v1(68.86,28.58) v1(71.37,18.92) v1(71.37,18.03) v1(72.22,18.92) v1(72.29,18.03) v1(77.09,29.21) v1(77.09,28.32) v1(77.93,29.21) v1(78,28.32) v1(78.74,35.69) v1(78.74,34.8) v1(79.38,4.32) v1(79.58,35.69) v1(79.63,18.03) v1(79.66,34.8) v1(81.66,55.5) v1(85.52,16.06) v1(85.52,9.05) v1(85.98,3.81) v1(85.98,2.92) v1(86.82,3.81) v1(86.9,2.92) v1(87.12,26.92) v1(87.38,36.83) v1(87.38,35.94) v1(88.22,36.83) v1(88.29,35.94) v1(91.44,57.02) v1(91.44,56.13) v1(92.28,57.02) v1(92.36,56.13) v1(92.96,11.43) v1(93.34,22.86) v1(93.85,16.76)
VBAT: length 99.8
  Top Layer w0.508: R6.2 86.86,55.89 86.35,56.39 69.47,56.39 68.96,55.89 CN4.4 68.96,51.31 67.44,49.78 63.37,49.78 61.59,48.01 v1(61.59,42.8) ; v1(21.34,43.43) 21.34,45.47 22.1,46.23 31.88,46.23 35.31,42.8 v1(45.72,42.8) ; v1(21.34,41.97) 13.02,41.97 12.7,42.29 v1(12.7,45.13)
  Bottom Layer w0.508: v1(61.59,42.8) v1(45.72,42.8)
  vias: v1(5.97,48.13) v1(5.97,46.79) v1(5.97,45.1) v1(10.41,48.13) v1(10.41,46.86) v1(12.7,48.13) v1(12.7,46.63) v1(14.12,46.63) v1(21.34,40.74)
VCC: length 296.4
  Top Layer w0.508: v1(73.41,24.77) 68.83,24.77 67.82,23.75 v1(67.82,12.06) ; v1(21.34,21.34) 40.77,21.34 H1.3 ; U1.4 27.73,36.13 C3.2 ; 56.52,2.29 50.04,2.29 49.75,2.58 v1(49.75,3.68) ; 56.52,2.29 56.56,2.32 CN5.7 ; 56.52,2.29 72.26,2.29 72.9,2.92 72.9,11.05 71.88,12.06 v1(69.97,12.06) ; v1(38.99,3.81) 39.12,3.68 U4.1 ; v1(25.03,33.1) 25.03,21.34 ; v1(60.32,47.88) 60.99,48.55 R29.2 ; v1(55.12,52.08) 55.12,50.62 R28.2 54.79,50.3 ; R21.2 54.79,50.3 ; 54.79,50.3 54.99,50.1 54.99,48.26 55.37,47.88 v1(56.13,47.88) ; v1(41.53,41.28) 33.53,41.28 32.64,40.39 32.64,35.34 ; v1(32.64,33.27) 32.64,35.34 ; 32.64,35.34 32.86,35.56 43.56,35.56 43.96,35.16 C23.2 C20.2 44.08,30.48 47.62,30.48 48.13,29.97 U10.12 ; 92.84,46.72 92.82,46.74 v1(92.71,46.74) ; 92.84,46.72 92.84,47.75 93.22,48.13 U3.2 ; 92.84,46.72 92.84,45.82 92.85,45.81 92.85,44.77 ; U11.4 v1(73.34,44.32) 71.84,44.32 C15.1 ; C11.2 92.85,44.77 ; 92.85,44.77 94.82,44.77 R3.1 ; v1(21.34,13.59) 21.34,4.7 22.1,3.94 U8.1 25.65,3.94 v1(26.54,4.83) ; v1(88.77,57.78) 65.41,57.78 64.52,56.9 v1(64.52,52.96) ; v1(41.53,44.2) 41.53,49.78 42.16,50.42 44.81,50.42 R18.2
  Bottom Layer w0.508: v1(26.54,4.83) 37.97,4.83 v1(38.99,3.81) ; v1(73.41,24.77) 73.41,44.26 v1(73.34,44.32) ; v1(21.34,13.59) v1(21.34,21.34) 21.21,21.46 v1(14.61,21.46) ; v1(88.77,57.78) 88.77,47.24 89.28,46.74 v1(92.71,46.74) ; v1(60.32,47.88) v1(56.13,47.88) ; v1(44.96,52.08) v1(55.12,52.08) ; v1(41.53,41.28) v1(41.53,44.2)
  vias: v1(18.67,33.78) v1(27.94,33.27) v1(30.95,33.27) v1(46.74,50.29) v1(48.51,5.21) v1(48.51,3.68) v1(49.62,5.21) v1(61.72,51.94)
VEE: length 20.1
  Top Layer w0.508: C13.2 84.64,44.32 v1(82.75,44.32) U11.11 ; v1(88.52,44.32) 88.52,48.51 89.03,49.02 91.12,49.02 C8.2 94.48,49.09 U3.1
  Bottom Layer w0.508: v1(82.75,44.32) v1(88.52,44.32)
0: length 69.1
  Top Layer w0.508: v1(37.85,9.78) v1(37.85,18.16) 18.8,18.16 ; R16.2 v1(29.59,6.1) ; v1(14.61,23.62) 18.16,23.62 18.8,22.99 18.8,18.16 ; R27.2 v1(7.75,6.22) ; 18.8,18.16 18.8,10.67 18.16,10.03 v1(15.62,10.03)
  Bottom Layer w0.508: v1(35.94,9.02) 35.94,6.35 35.69,6.1 v1(29.59,6.1) ; v1(7.75,6.22) 13.72,6.22 14.22,6.73 v1(14.22,9.02)
485_RXD: length 38.4
  Top Layer w0.254: U6.1 46.86,47.88 46.35,48.39 45.07,48.39 R18.1 44.96,49.02 45.21,49.28 53.59,49.28 54.23,48.64 54.23,45.24 54.24,45.23 54.24,41.77 55.12,40.89 58.17,40.89 59.56,39.5 U10.3
485_TXD: length 28.2
  Top Layer w0.254: U10.4 58.29,39.24 57.15,40.39 53.72,40.39 52.71,41.4 52.71,48.39 51.05,48.39 50.67,48.01 U6.4
ADC0: length 45.6
  Top Layer w0.254: U10.6 55.75,27.18 56.13,26.8 64.01,26.8 64.77,27.56 64.77,31.5 65.91,32.64 83.82,32.64 84.58,33.4 R5.1 83.55,39.77 82.8,40.51 U11.8
ADC1: length 62.6
  Top Layer w0.254: U11.14 79.5,48.13 79.12,47.75 79.12,47.24 79.5,46.86 U11.13 ; U10.7 54.48,26.67 54.81,26.34 84.63,26.34 84.96,26.67 v1(84.96,30.1)
  Bottom Layer w0.254: v1(79.12,47.43) 78.99,47.31 78.99,43.93 79.25,43.68 84.34,43.68 84.96,43.05 v1(84.96,30.1)
HEAT1: length 4
  Top Layer w0.254: CN5.1 62.55,9.21 62.74,9.4 U5.3
HEAT2: length 3.8
  Top Layer w0.254: U7.3 55.33,9.31 55.56,9.09 CN5.8
KC1: length 12.2
  Top Layer w0.254: RELAY1.1 93.98,20.83 94.9,21.75 CN2.1
KC2: length 7.3
  Top Layer w0.254: CN3.1 93.6,7.62 RELAY2.1
KO1: length 32
  Top Layer w0.254: CN2.3 95.02,36.96 97.16,36.96 97.54,36.58 97.54,29.46 96.9,28.83 86.11,28.83 85.72,28.45 85.72,21.46 85.09,20.83 RELAY1.10
KO2: length 31.4
  Top Layer w0.254: RELAY2.10 83.06,5.84 83.95,4.95 95.76,4.95 97.28,6.48 97.28,18.16 96.36,19.08 CN3.3
KX1: length 12.1
  Top Layer w0.254: CN2.2 93.89,30.99 RELAY1.5 RELAY1.6
KX2: length 15.5
  Top Layer w0.254: RELAY2.6 RELAY2.5 88.14,14.48 88.77,13.84 94.74,13.84 CN3.2
P12: length 30.1
  Top Layer w0.254: U6.3 49.4,47.75 49.15,48.01 48.39,48.01 48.13,47.75 U6.2 48.15,46.49 R19.1 48.15,40.5 49.02,39.62 56.01,39.62 57.02,38.61 U10.5
P20: length 19.3
  Top Layer w0.254: U10.23 55.75,12.57 55.25,12.06 48.51,12.06 48.13,11.68 C18.2 52.28,10.3 U7.1
P21: length 12.6
  Top Layer w0.254: CN5.5 58.55,15.11 57.02,16.64 U10.24
P22: length 12.5
  Top Layer w0.254: U10.25 58.29,16.51 59.55,15.25 CN5.4
P23: length 12.4
  Top Layer w0.254: U10.26 59.56,16.26 60.55,15.26 CN5.3
P24: length 12.3
  Top Layer w0.254: 60.83,18.28 60.83,16.26 61.55,15.53 CN5.2
P25: length 23.9
  Top Layer w0.254: U10.28 62.1,16.51 64.52,14.1 64.52,6.99 65.02,6.48 69.6,6.48 69.9,6.78 R17.2 69.81,8.45 U5.1
P36: length 35.7
  Top Layer w0.254: R26.1 23.88,14.22 24.51,14.86 v1(36.72,14.86) ; v1(39.62,14.86) 52.2,14.86 53.21,15.88 53.21,18.28
  Bottom Layer w0.254: v1(36.72,14.86) v1(39.62,14.86)
P37: length 15.6
  Top Layer w0.254: R15.1 45.85,13.59 46.35,14.1 53.59,14.1 54.48,14.99 U10.22
SCL: length 26.4
  Top Layer w0.254: 60.83,28.2 60.83,39.62 56.96,43.5 R28.1 57.15,50.65 U9.5
SDA: length 26.3
  Top Layer w0.254: U10.1 62.1,40.39 58.99,43.49 R29.1 58.99,50.99 58.42,51.56 U9.6
SN+: length 17.4
  Top Layer w0.254: U11.3 76.48,45.59 77.55,44.53 77.8,44.53 77.98,44.71 77.98,48.54 77.73,48.8 77.73,49.05 77.98,49.3 77.98,49.56 77.73,49.81 77.73,50.07 77.98,50.32 77.98,50.83 81.46,54.3 81.46,54.56 81.28,54.74 CN4.2
SN-: length 17.4
  Top Layer w0.254: CN4.1 82.47,54.74 78.39,50.66 78.39,44.54 76.9,43.05 U11.5
VRM: length 185.9
  Top Layer w0.508: 3.05,16.08 6.01,16.08 R24.2 ; 3.05,16.08 3.05,6.22 4.7,4.57 v1(4.83,4.57) ; 3.05,16.08 3.05,26.54 3.68,27.18 U2.4 ; 75.78,14.07 D5.1 75.78,2.83 v1(75.82,2.79) ; 75.78,14.07 75.81,14.1 v1(75.82,14.1) ; 75.78,14.07 75.78,23.29 D3.1 ; v1(79.76,14.1) 86.74,14.1 88.14,12.7 RELAY2.2 88.26,10.03 v1(90.93,10.03) ; RELAY1.2 v1(90.93,23.37) ; 19.9,2.19 26.51,2.19 v1(26.54,2.16) ; 19.9,2.19 19.94,2.23 19.94,15.11 20.69,15.86 R9.2 ; 19.9,2.19 9.58,2.19 ; v1(7.24,2.16) 7.27,2.19 9.58,2.19 ; R25.1 9.54,2.23 9.58,2.19 ; R14.1 v1(29.08,3.68)
  Bottom Layer w0.508: v1(7.24,2.16) v1(4.83,4.57) ; v1(90.93,23.37) v1(90.93,10.03) ; v1(29.08,3.68) 26.8,3.68 26.54,3.43 v1(26.54,2.16) 75.18,2.16 v1(75.82,2.79) ; v1(79.76,14.1) v1(75.82,14.1)
  vias: v1(17.27,28.32) v1(17.27,26.71) v1(18.16,27.43)
XTAL1: length 9.4
  Top Layer w0.254: U10.10 50.67,29.84 49.8,30.72 C19.1 49.8,33.19 49.78,33.2 49.78,35.56 49.4,35.94 X1.2
XTAL2: length 8.9
  Top Layer w0.254: X1.1 52.2,35.94 51.82,35.56 51.82,32.37 C22.1 51.93,28.21 U10.9
$1N5406: length 16
  Top Layer w0.254: v1(4.7,50.8) 7.16,50.8 F1.1 ; CN1.1 4.83,37.81 v1(4.83,43.31)
  Bottom Layer w0.254: v1(4.7,50.8) 4.7,43.43 v1(4.83,43.31)
$1N6010: length 5.2
  Top Layer w0.254: U1.2 24.33,37.14 L1.2
$1N7874: length 5.7
  Top Layer w0.254: R3.2 98.04,44.58 98.43,44.96 98.43,47.75 98.04,48.13 U3.5
$1N8048: length 5.4
  Top Layer w0.254: U3.6 98.61,49.08 98.81,49.28 98.81,51.51 98.63,51.69 C7.2
$1N8053: length 7.2
  Top Layer w0.254: C7.1 95.5,51.69 95.88,51.31 95.88,47.5 95.57,47.18 U3.3
$1N8284: length 2.3
  Top Layer w0.508: LED1.2 R1.2
$1N8627: length 12.9
  Top Layer w0.254: SW1.1 3.68,50 3.94,50.25 3.94,53.85 4.52,54.43 F1.2 11.06,54.43 D2.1
$2N2031: length 8.5
  Top Layer w0.254: U11.7 73.91,40.51 72.76,39.36 C16.1 71.85,39.39 R11.1 69.49,39.37 R12.2
$2N2092: length 16.6
  Top Layer w0.254: R13.2 71.52,37.05 R12.1 75.82,37.08 76.84,38.1 76.84,42.29 77.6,43.05 U11.10
$2N2099: length 6.1
  Top Layer w0.254: 80.75,41.78 R4.1
$2N2266: length 10.8
  Top Layer w0.254: 64.64,46.57 69.57,46.57 R8.1 71.59,46.55 C14.1 73.19,46.39 73.66,46.86 U11.2
$2N2273: length 29.9
  Top Layer w0.254: v1(77.09,48.13) U11.1 73.79,48.13 73.47,48.45 C14.2 71.65,48.55 R8.2 68.11,48.55 v1(68.07,48.51) ; v1(82.8,42.93) 88.52,42.93 88.65,42.8 88.65,40.13 88.3,39.78 R4.2
  Bottom Layer w0.254: v1(82.8,42.93) 78.23,42.93 77.09,44.07 v1(77.09,48.13)
$2N2314: length 13.2
  Top Layer w0.254: 75.21,41.78 73.79,41.78 73.42,41.42 C16.2 71.85,41.39 R11.2 69.29,41.57 R10.3 64.9,43.81 64.64,44.07
$2N3023: length 8.7
  Top Layer w0.254: CN6.1 37.47,53.97 37.97,54.48 R20.1
$2N3053: length 6.9
  Top Layer w0.254: R22.1 43.16,56.53 42.67,57.02 CN6.2
$2N3244: length 11.2
  Top Layer w0.254: U6.6 49.4,56.13 49.22,56.32 D4.1 48,57.79 47.26,58.53 R22.2
$2N3251: length 4.5
  Top Layer w0.254: R20.2 47.94,54.48 D4.2 48.13,54.29 U6.7
$2N3377: length 2.3
  Top Layer w0.254: R15.2 45.85,6.28 U4.2
$2N3466: length 7.3
  Top Layer w0.254: U4.4 R14.2 R16.1 33.28,6.12 Q1.1
$2N4164: length 2.5
  Top Layer w0.254: U8.2 23.88,6.55 R26.2
$2N4168: length 6.8
  Top Layer w0.254: Q2.1 11.44,6.23 R27.1 11.44,4.03 R25.2 U8.4
$2N4738: length 2.2
  Top Layer w0.254: R9.1 LED2.1
$2N4742: length 86.3
  Top Layer w0.254: Q1.3 LED2.2 28.07,2.16 28.75,1.47 77.04,1.47 78.36,2.79 78.36,23.11 78.61,23.37 D3.2 RELAY1.9
$2N4893: length 2.4
  Top Layer w0.254: 6.1,11.56 R24.1
$2N4914: length 94.7
  Top Layer w0.254: 80.18,9.53 80.18,2.2 78.99,1.02 6.86,1.02 6.1,1.78 6.1,8.38 ; D5.2 RELAY2.9 ; Q2.3 LED3.2
$2N5025: length 6.5
  Top Layer w0.254: R6.1 R7.1 83.25,46.55 82.3,45.59 U11.12
$2N7138: length 13.1
  Top Layer w0.254: U10.16 46.86,25.15 45.85,26.16 H1.1
$2N7141: length 9.3
  Top Layer w0.254: 45.59,18.28 45.59,22.61 44.58,23.62 H1.2

## Copper pours and planes (outline as drawn; the poured copper is in the pictures)
GND on Top Layer: -2.54,62.23 102.36,62.23 102.36,-1.78 -2.54,-1.78
GND on Bottom Layer: -5.97,66.8 105.03,66.8 105.03,-5.72 -5.97,-5.72
VBAT on Top Layer: 1.65,49.02 1.14,48.51 1.14,47.37 1.52,46.99 3.05,46.99 3.43,46.61 3.43,44.83 4.32,43.94 13.08,43.94 14.86,45.72 14.86,48.01 13.84,49.02
VBAT on Top Layer: 20.07,44.45 19.43,43.81 19.43,40.51 19.94,40 23.11,40 23.62,40.51 23.62,44.2 23.37,44.45
VCC on Top Layer: 65.91,12.7 65.91,12.57 64.9,11.56 64.9,9.84 65.34,9.4 71.37,9.4 72.01,10.03 72.01,11.43 70.74,12.7
VCC on Top Layer: 60.72,54.48 60.32,54.1 60.32,51.82 60.07,51.56 60.07,49.28 60.32,49.02 61.85,49.02 62.36,49.53 62.36,51.56 62.61,51.82 64.9,51.82 65.15,52.07 65.15,53.85 64.52,54.48
VCC on Top Layer: 17.53,39.24 16.38,38.1 16.38,33.91 17.53,32.77 22.99,32.77 23.5,32.26 23.5,30.23 24.26,29.46 32,29.46 33.4,30.86 33.4,33.27 32.38,34.29 29.64,34.29 28.96,34.98 28.96,39.24 28.57,39.62 26.67,39.62 26.29,39.24 26.29,35.05 25.73,34.49 23.17,34.49 23.11,34.54 23.11,38.23 22.1,39.24
VCC on Top Layer: 44.54,5.08 44.07,4.61 44.07,2.92 44.45,2.54 50.16,2.54 50.8,3.18 50.8,6.6 51.05,6.86 52.9,6.86 53.67,7.62 53.67,8.91 53.27,9.31 47.28,9.31 46.99,9.02 46.99,7.26 47.38,6.87 47.38,5.22 47.24,5.08
VCC on Top Layer: 5.46,22.99 4.95,22.48 4.95,21.08 5.59,20.45 16.13,20.45 16.89,21.21 16.89,22.35 16.26,22.99
VCC on Top Layer: 44.2,53.21 43.69,52.7 43.69,50.06 44.27,49.48 47.07,49.48 47.5,49.91 47.5,52.83 47.12,53.21
0 on Top Layer: 10.99,10.92 10.59,10.52 10.59,9.42 10.99,9.02 12.18,9.02 12.5,8.69 12.5,5.4 12.83,5.08 16.51,5.08 17.02,5.59 17.02,10.16 16.26,10.92
0 on Top Layer: 5.33,25.65 4.7,25.02 4.7,24 5.59,23.11 15.75,23.11 16.64,24 16.64,25.02 16,25.65
0 on Top Layer: 32.83,11.05 32.43,10.65 32.43,9.55 32.83,9.14 34.03,9.14 34.35,8.82 34.35,5.53 34.67,5.21 38.35,5.21 38.86,5.72 38.86,10.29 38.1,11.05
VRM on Top Layer: 6.49,29.12 5.37,29.12 4.7,28.45 4.7,26.8 5.72,25.78 18.03,25.78 18.8,26.54 18.8,28.07 17.65,29.21 6.59,29.21

Small or netless copper shapes (teardrops, artwork), in the pictures only: 368 on Top Layer, 40 on Bottom Layer
